# Altium project RFC_MB.PrjPcb (part 1 of 7)
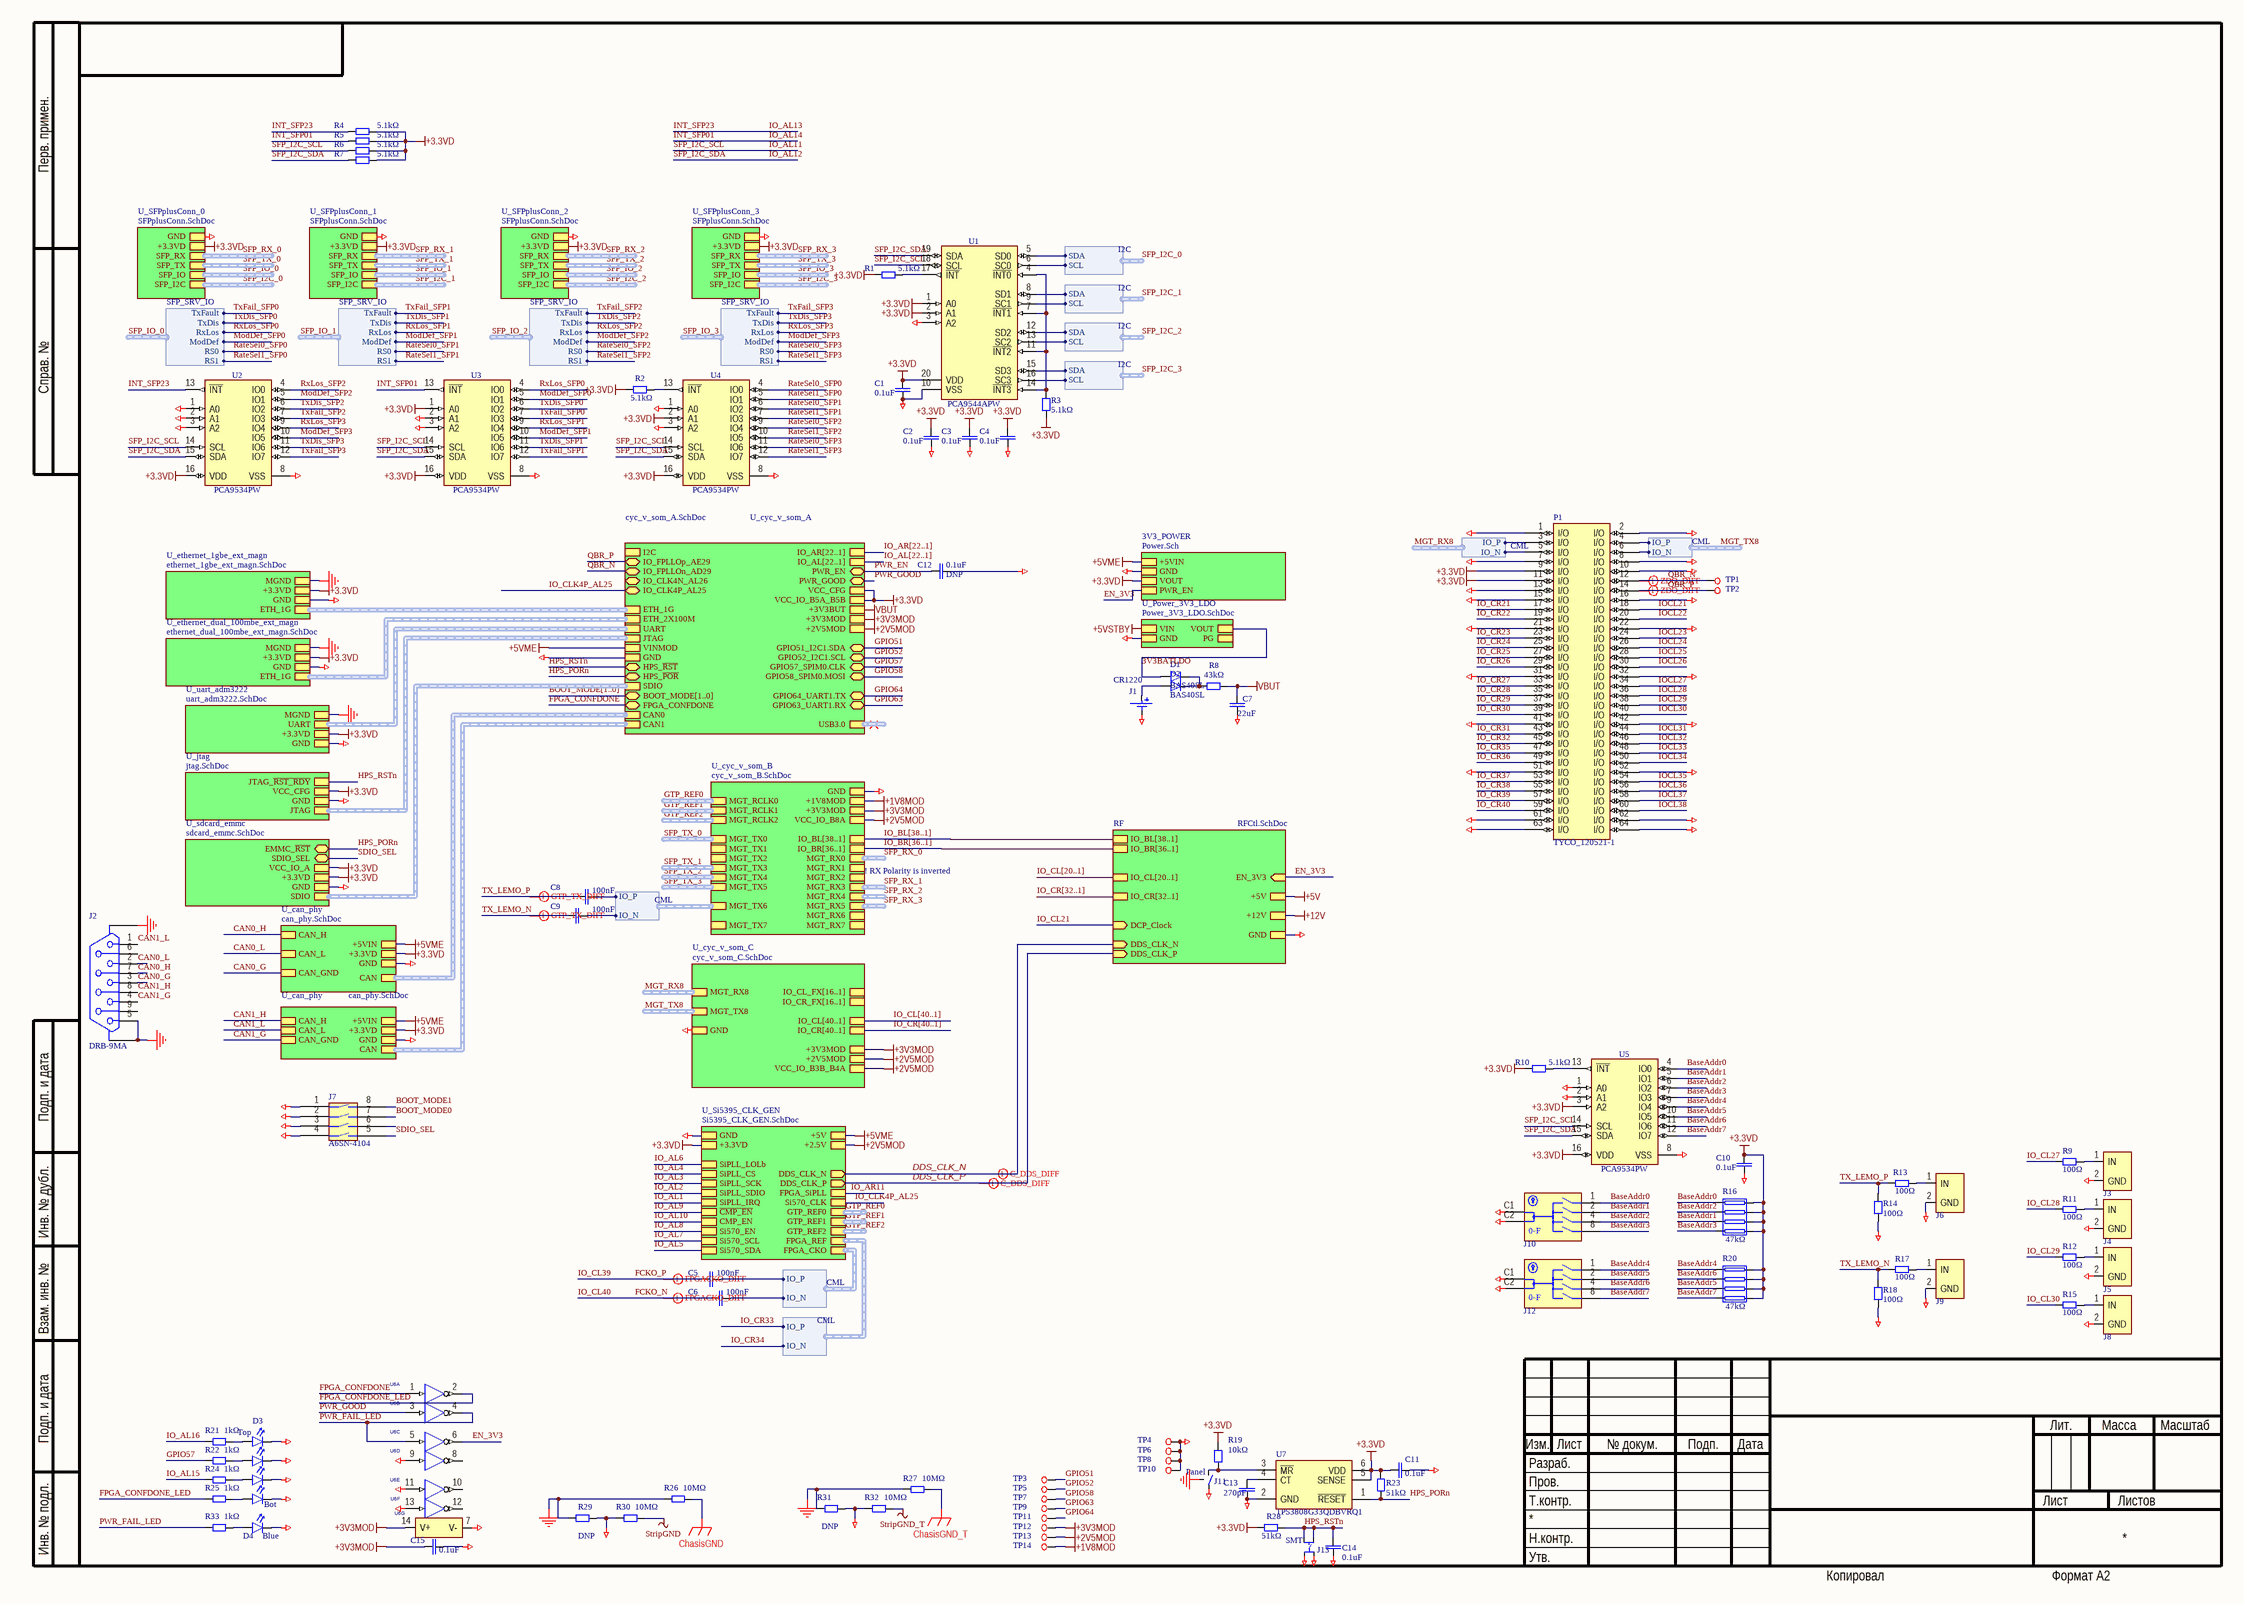
[diagram p0: main.SchDoc]
26 sheets, 1240 parts. Net scope: strictly hierarchical (ports join the sheet entries above them; power ports are local).
Board file: RFC_MB.PcbDoc
Sheets:
  main.SchDoc
    U_cyc_v_som_A = cyc_v_som_A.SchDoc
    U_cyc_v_som_B = cyc_v_som_B.SchDoc
    U_cyc_v_som_C = cyc_v_som_C.SchDoc
    U_ethernet_1gbe_ext_magn = ethernet_1gbe_ext_magn.SchDoc
    U_ethernet_dual_100mbe_ext_magn = ethernet_dual_100mbe_ext_magn.SchDoc
    U_uart_adm3222 = uart_adm3222.SchDoc
    U_jtag = jtag.SchDoc
    U_sdcard_emmc = sdcard_emmc.SchDoc
    U_can_phy = can_phy.SchDoc
    U_can_phy = can_phy.SchDoc
    U_Power_3V3_LDO = Power_3V3_LDO.SchDoc
    U_SFPplusConn_0 = SFPplusConn.SchDoc
    U_SFPplusConn_1 = SFPplusConn.SchDoc
    U_SFPplusConn_2 = SFPplusConn.SchDoc
    U_SFPplusConn_3 = SFPplusConn.SchDoc
    RF = RFCtl.SchDoc
      RF_H = Hall.SchDoc
        H_DCDC = DCDC_Hall.SchDoc
          DCP_H- = DCP_DC_DC.SchDoc
      RF_i = Integrator.SchDoc
        i_DCDC = DCDC_int.SchDoc
          DCP_i- = DCP_DC_DC.SchDoc
          DCP_i+ = DCP_DC_DC.SchDoc
      RF_D = DDS.SchDoc
        D_DCDC = DCDC_DDS.SchDoc
          DCP_D+ = DCP_DC_DC.SchDoc
          DCP_D- = DCP_DC_DC.SchDoc
      RF_S = SlowChans.SchDoc
        S_DCDC = DCDC_Slow.SchDoc
          DCP_S+ = DCP_DC_DC.SchDoc
          DCP_S- = DCP_DC_DC.SchDoc
    U_Si5395_CLK_GEN = Si5395_CLK_GEN.SchDoc
      U_power_REG104GA_1V8 = power_REG104GA_1V8.SchDoc
      U_power_REG104GA_3V3 = power_REG104GA_3V3.SchDoc
  Si5395_CLK_PWR.SchDoc

## Sheet main.SchDoc
size 594 x 420 mm

### Parts
C1  0.1uF  [CAPC2012N]
C2  0.1uF  [CAPC2012N]
C3  0.1uF  [CAPC2012N]
C4  0.1uF  [CAPC2012N]
C5  100nF  [CAPC1608N]
C6  100nF  [CAPC1608N]
C7  22uF  [CAPC2012N]
C8  100nF  [CAPC1608N]
C9  100nF  [CAPC1608N]
C10  0.1uF  [CAPC2012N]
C11  0.1uF  [CAPC2012N]
C12  PartField: 0.1uF  [CAPC2012N]  (hidden comment: DNP)
C13  270pF  [CAPC2012N]
C14  0.1uF  [CAPC2012N]
C15  0.1uF  [CAPC2012N]
D1  BAS40SL  [SOD_923]
D2  BAS40SL  [SOD_923]
D3  H485CGDL  [LED_H485C]  (value not drawn)
D4  Color: Blue  [LEDC1608N]  (hidden comment: LB Q39E-N1OO-35-1)
J1  BC501SM  [BAT_CR1220]  (value not drawn)
J2  DRB-9MA  [DRB-9MA]
J3  DNP  [LEMO_EPA.00.250.NTN]  (value not drawn)
J4  DNP  [LEMO_EPA.00.250.NTN]  (value not drawn)
J5  DNP  [LEMO_EPA.00.250.NTN]  (value not drawn)
J6  DNP  [LEMO_EPA.00.250.NTN]  (value not drawn)
J7  A6SN-4104  [DIPSW4-A6SN8]
J8  DNP  [LEMO_EPA.00.250.NTN]  (value not drawn)
J9  DNP  [LEMO_EPA.00.250.NTN]  (value not drawn)
J10  ERD116XSZ  [SW_ECE_ERD116XSZ]  (value not drawn)
J11  PTS645VL582LFS  [PTS645VL582LFS]  (value not drawn)
J12  ERD116XSZ  [SW_ECE_ERD116XSZ]  (value not drawn)
J13  PTS645SL43SMTR92  [PTS645SL43SMTR92]  (value not drawn)
P1  TYCO_120521-1  [TYCO_120521-1]
R1  5.1kΩ  [RESC2012N]
R2  5.1kΩ  [RESC2012N]
R3  5.1kΩ  [RESC2012N]
R4  5.1kΩ  [RESC2012N]
R5  5.1kΩ  [RESC2012N]
R6  5.1kΩ  [RESC2012N]
R7  5.1kΩ  [RESC2012N]
R8  43kΩ  [RESC2012N]
R9  100Ω  [RESC1608N]
R10  5.1kΩ  [RESC2012N]
R11  100Ω  [RESC1608N]
R12  100Ω  [RESC1608N]
R13  100Ω  [RESC1608N]
R14  100Ω  [RESC1608N]
R15  100Ω  [RESC1608N]
R16  value 47kΩ  [CAY16-J4]  (hidden comment: CAY16-4702F4LF)
R17  100Ω  [RESC1608N]
R18  100Ω  [RESC1608N]
R19  10kΩ  [RESC2012N]
R20  value 47kΩ  [CAY16-J4]  (hidden comment: CAY16-4702F4LF)
R21  1kΩ  [RESC2012N]
R22  1kΩ  [RESC2012N]
R23  51kΩ  [RESC2012N]
R24  1kΩ  [RESC2012N]
R25  1kΩ  [RESC2012N]
R26  10MΩ  [RESC2012N]
R27  10MΩ  [RESC2012N]
R28  51kΩ  [RESC2012N]
R29  DNP  [RESC2012N]
R30  10MΩ  [RESC2012N]
R31  DNP  [RESC2012N]
R32  10MΩ  [RESC2012N]
R33  1kΩ  [RESC2012N]
TP1  test point  [TEST_POINT]  (value not drawn)  (no BOM)
TP2  test point  [TEST_POINT]  (value not drawn)  (no BOM)
TP3  test point  [TEST_POINT]  (value not drawn)  (no BOM)
TP4  test point  [TEST_POINT]  (value not drawn)  (no BOM)
TP5  test point  [TEST_POINT]  (value not drawn)  (no BOM)
TP6  test point  [TEST_POINT]  (value not drawn)  (no BOM)
TP7  test point  [TEST_POINT]  (value not drawn)  (no BOM)
TP8  test point  [TEST_POINT]  (value not drawn)  (no BOM)
TP9  test point  [TEST_POINT]  (value not drawn)  (no BOM)
TP10  test point  [TEST_POINT]  (value not drawn)  (no BOM)
TP11  test point  [TEST_POINT]  (value not drawn)  (no BOM)
TP12  test point  [TEST_POINT]  (value not drawn)  (no BOM)
TP13  test point  [TEST_POINT]  (value not drawn)  (no BOM)
TP14  test point  [TEST_POINT]  (value not drawn)  (no BOM)
U1  PCA9544APW  [SOP65P640X110-20N]
U2  PCA9534PW  [SOP65P640X110-16N]
U3  PCA9534PW  [SOP65P640X110-16N]
U4  PCA9534PW  [SOP65P640X110-16N]
U5  PCA9534PW  [SOP65P640X110-16N]
U6  SN74LVC04APW  [SOP65P640X110-14N]  (value not drawn)  (parts A,B,C,D,E,F,G of 7)
U7  TPS3808G33QDBVRQ1  [SOT95P280X100-6N]

### Sub-sheets
3V3_POWER = Power.Sch (file not in this document): +5VIN, GND, VOUT, PWR_EN
RF = RFCtl.SchDoc: IO_BL[38..1], EN_3V3 (in), DDS_CLK_N (in), DDS_CLK_P (in), IO_CL[20..1], IO_CR[32..1], IO_BR[36..1], +5V, +12V, GND, DCP_Clock (in)
U_can_phy = can_phy.SchDoc: CAN (harness CAN), GND, +3.3VD, CAN_H, CAN_L, CAN_GND, +5VIN
U_can_phy = can_phy.SchDoc: CAN (harness CAN), GND, +3.3VD, CAN_H, CAN_L, CAN_GND, +5VIN
U_cyc_v_som_A = cyc_v_som_A.SchDoc: ETH_1G (harness EthLanes), ETH_2X100M (harness EthLanes), UART (harness UART), I2C (harness I2C), GND, VINMOD, HPS_~{RST} (bidir), HPS_~{POR} (bidir), SDIO (harness SDIO), BOOT_MODE[1..0] (bidir), FPGA_CONFDONE (bidir), CAN0 (harness CAN), CAN1 (harness CAN), IO_AR[22..1], +2V5MOD, +3V3MOD, GPIO52_I2C1.SCL (bidir), GPIO63_UART1.RX (bidir), GPIO51_I2C1.SDA (bidir), GPIO57_SPIM0.CLK (bidir), GPIO64_UART1.TX (bidir), USB3.0 (harness USB3), GPIO58_SPIM0.MOSI (bidir), +3V3BUT, IO_CLK4N_AL26 (bidir), IO_CLK4P_AL25 (bidir), PWR_EN (bidir), PWR_GOOD (bidir), VCC_IO_B5A_B5B, VCC_CFG, IO_FPLLOp_AE29 (bidir), IO_AL[22..1], IO_FPLLOn_AD29 (bidir), JTAG
U_cyc_v_som_B = cyc_v_som_B.SchDoc: GND, MGT_RCLK2 (harness CML), MGT_RCLK1 (harness CML), IO_BL[38..1], IO_BR[36..1], MGT_RCLK0 (harness CML), +1V8MOD, +3V3MOD, VCC_IO_B8A, MGT_TX5 (harness CML), MGT_TX3 (harness CML), MGT_TX6 (harness CML), MGT_TX7 (harness CML), MGT_TX2 (harness CML), MGT_TX1 (harness CML), MGT_TX4 (harness CML), MGT_TX0 (harness CML), MGT_RX0 (harness CML), MGT_RX1 (harness CML), MGT_RX6 (harness CML), MGT_RX4 (harness CML), MGT_RX5 (harness CML), MGT_RX3 (harness CML), MGT_RX2 (harness CML), MGT_RX7 (harness CML)
U_cyc_v_som_C = cyc_v_som_C.SchDoc: GND, MGT_TX8 (harness CML), IO_CL_FX[16..1], IO_CR_FX[16..1], MGT_RX8 (harness CML), IO_CL[40..1], IO_CR[40..1], +3V3MOD, +2V5MOD, VCC_IO_B3B_B4A
U_ethernet_1gbe_ext_magn = ethernet_1gbe_ext_magn.SchDoc: ETH_1G (harness EthLanes), GND, +3.3VD, MGND
U_ethernet_dual_100mbe_ext_magn = ethernet_dual_100mbe_ext_magn.SchDoc: ETH_1G (harness EthLanes), GND, +3.3VD, MGND
U_jtag = jtag.SchDoc: JTAG (harness JTAG), GND, VCC_CFG, JTAG_~{RST_RDY}
U_Power_3V3_LDO = Power_3V3_LDO.SchDoc: GND, VOUT, VIN, PG
U_sdcard_emmc = sdcard_emmc.SchDoc: SDIO (harness SDIO), GND, +3.3VD, VCC_IO_A, SDIO_SEL (bidir), EMMC_~{RST} (bidir)
U_SFPplusConn_0 = SFPplusConn.SchDoc: GND, +3.3VD, SFP_TX (harness CML), SFP_RX (harness CML), SFP_IO (harness SFP_SRV_IO), SFP_I2C (harness I2C)
U_SFPplusConn_1 = SFPplusConn.SchDoc: GND, +3.3VD, SFP_TX (harness CML), SFP_RX (harness CML), SFP_IO (harness SFP_SRV_IO), SFP_I2C (harness I2C)
U_SFPplusConn_2 = SFPplusConn.SchDoc: GND, +3.3VD, SFP_TX (harness CML), SFP_RX (harness CML), SFP_IO (harness SFP_SRV_IO), SFP_I2C (harness I2C)
U_SFPplusConn_3 = SFPplusConn.SchDoc: GND, +3.3VD, SFP_TX (harness CML), SFP_RX (harness CML), SFP_IO (harness SFP_SRV_IO), SFP_I2C (harness I2C)
U_Si5395_CLK_GEN = Si5395_CLK_GEN.SchDoc: GND, +3.3VD, +5V, Si570_CLK, Si570_SCL, Si570_SDA, Si570_EN, ~{CMP_EN}, CMP_EN, +2.5V, FPGA_SiPLL, GTP_REF1 (harness CML), GTP_REF0 (harness CML), GTP_REF2 (harness CML), FPGA_CKO (harness CML), SiPLL_IRQ, SiPLL_SDIO, SiPLL_SCK, SiPLL_CS, FPGA_REF (harness CML), SiPLL_LOLb, DDS_CLK_N (out), DDS_CLK_P (out)
U_uart_adm3222 = uart_adm3222.SchDoc: GND, +3.3VD, UART (harness UART), MGND

### Harnesses
I2C: SDA, SCL
SFP_SRV_IO: TxDis, TxFault, RS0, RS1, ModDef, RxLos
CML: IO_N, IO_P

### Nets
+1V8MOD: TP14.1 ; sheet U_cyc_v_som_B/+1V8MOD
+2V5MOD: TP13.1 ; sheet U_cyc_v_som_A/+2V5MOD, sheet U_cyc_v_som_B/VCC_IO_B8A, sheet U_cyc_v_som_C/+2V5MOD, sheet U_cyc_v_som_C/VCC_IO_B3B_B4A, sheet U_Si5395_CLK_GEN/+2.5V
+3.3VD: C1.1 C2.1 C3.1 C4.1 C10.1 C11.2 P1.9(I/O) P1.11(I/O) R1.1 R2.1 R3.2 R4.2 R5.2 R6.2 R7.2 R10.1 R16.5 R16.6 R16.7 R16.8 R19.1 R20.5 R20.6 R20.7 R20.8 R23.1 R28.1 U1.1(A0) U1.2(A1) U1.20(VDD) U2.16(VDD) U3.1(A0) U3.16(VDD) U4.2(A1) U4.16(VDD) U5.3(A2) U5.16(VDD) U7.5(SENSE) U7.6(VDD) ; sheet U_cyc_v_som_A/VCC_IO_B5A_B5B, sheet U_cyc_v_som_A/VCC_CFG, sheet U_ethernet_1gbe_ext_magn/+3.3VD, sheet U_ethernet_dual_100mbe_ext_magn/+3.3VD, sheet U_uart_adm3222/+3.3VD, sheet U_jtag/VCC_CFG, sheet U_sdcard_emmc/+3.3VD, sheet U_sdcard_emmc/VCC_IO_A, sheet 3V3_POWER/VOUT, sheet U_can_phy/+3.3VD, sheet U_can_phy/+3.3VD, sheet U_SFPplusConn_0/+3.3VD, sheet U_SFPplusConn_1/+3.3VD, sheet U_SFPplusConn_2/+3.3VD, sheet U_SFPplusConn_3/+3.3VD, sheet U_Si5395_CLK_GEN/+3.3VD
+3V3MOD: C15.2 TP12.1 U6.14(V+) ; sheet U_cyc_v_som_A/+3V3MOD, sheet U_cyc_v_som_B/+3V3MOD, sheet U_cyc_v_som_C/+3V3MOD
+5VME: sheet U_cyc_v_som_A/VINMOD, sheet 3V3_POWER/+5VIN, sheet U_can_phy/+5VIN, sheet U_can_phy/+5VIN, sheet U_Si5395_CLK_GEN/+5V
ChasisGND: R26.2
ChasisGND_T: R27.2
GND: C1.2 C2.2 C3.2 C4.2 C7.1 C10.2 C11.1 C12.1 C13.2 C14.2 C15.1 D3.2(C) D3.4(C) D3.6(C) D3.8(C) D4.1(C) J1.2(-) J3.2(GND) J4.2(GND) J5.2(GND) J6.2(GND) J7.1 J7.2 J7.3 J7.4 J8.2(GND) J9.2(GND) J10.C1(C) J10.C2(C) J11.2 J12.C1(C) J12.C2(C) J13.3 J13.4 P1.1(I/O) P1.2(I/O) P1.7(I/O) P1.8(I/O) P1.10(I/O) P1.13(I/O) P1.15(I/O) P1.16(I/O) P1.21(I/O) P1.22(I/O) P1.31(I/O) P1.32(I/O) P1.41(I/O) P1.42(I/O) P1.51(I/O) P1.52(I/O) P1.61(I/O) P1.62(I/O) P1.63(I/O) P1.64(I/O) R14.2 R18.2 R29.2 R30.1 R31.2 R32.1 TP4.1 TP6.1 TP8.1 TP10.1 U1.3(A2) U1.10(VSS) U2.1(A0) U2.2(A1) U2.3(A2) U2.8(VSS) U3.2(A1) U3.3(A2) U3.8(VSS) U4.1(A0) U4.3(A2) U4.8(VSS) U5.1(A0) U5.2(A1) U5.8(VSS) U6.7(V-) U6.9(A) U6.11(A) U6.13(A) U7.2(GND) ; sheet U_cyc_v_som_A/GND, sheet U_cyc_v_som_B/GND, sheet U_cyc_v_som_C/GND, sheet U_ethernet_1gbe_ext_magn/GND, sheet U_ethernet_dual_100mbe_ext_magn/GND, sheet U_uart_adm3222/GND, sheet U_jtag/GND, sheet U_sdcard_emmc/GND, sheet 3V3_POWER/GND, sheet U_can_phy/GND, sheet U_can_phy/GND, sheet U_Power_3V3_LDO/GND, sheet U_SFPplusConn_0/GND, sheet U_SFPplusConn_1/GND, sheet U_SFPplusConn_2/GND, sheet U_SFPplusConn_3/GND, sheet RF/GND, sheet U_Si5395_CLK_GEN/GND
MGND: J2.5 J2.S1(SHLD) J2.S2(SHLD) J11.0(S) R26.1 R27.1 R29.1 R31.1 ; sheet U_ethernet_1gbe_ext_magn/MGND, sheet U_ethernet_dual_100mbe_ext_magn/MGND, sheet U_uart_adm3222/MGND
StripGND: R30.2
StripGND_T: R32.2
VBUT: C7.2 R8.1 ; sheet U_cyc_v_som_A/+3V3BUT
3V3BATLDO: D1.1(A) ; sheet U_Power_3V3_LDO/VOUT
BaseAddr0: J10.1 R16.4 U5.4(IO0)
BaseAddr1: J10.2 R16.2 U5.5(IO1)
BaseAddr2: J10.4 R16.3 U5.6(IO2)
BaseAddr3: J10.8 R16.1 U5.7(IO3)
BaseAddr4: J12.1 R20.4 U5.9(IO4)
BaseAddr5: J12.2 R20.2 U5.10(IO5)
BaseAddr6: J12.4 R20.3 U5.11(IO6)
BaseAddr7: J12.8 R20.1 U5.12(IO7)
BOOT_MODE0: J7.7
BOOT_MODE1: J7.8
CAN0_G: J2.3 ; sheet U_can_phy/CAN_GND
CAN0_H: J2.7 ; sheet U_can_phy/CAN_H
CAN0_L: J2.2 ; sheet U_can_phy/CAN_L
CAN1_G: J2.4 ; sheet U_can_phy/CAN_GND
CAN1_H: J2.8 ; sheet U_can_phy/CAN_H
CAN1_L: J2.1 ; sheet U_can_phy/CAN_L
DDS_CLK_N: sheet RF/DDS_CLK_N, sheet U_Si5395_CLK_GEN/DDS_CLK_N
DDS_CLK_P: sheet RF/DDS_CLK_P, sheet U_Si5395_CLK_GEN/DDS_CLK_P
EN_3V3: U6.6(B) ; sheet 3V3_POWER/PWR_EN, sheet RF/EN_3V3
FCKO_N: C6.1  [also labelled IO_CL40]
FCKO_P: C5.1  [also labelled IO_CL39]
FPGA_CONFDONE: U6.1(A) ; sheet U_cyc_v_som_A/FPGA_CONFDONE
FPGA_CONFDONE_LED: R25.1 U6.2(B)
GPIO51: TP3.1 ; sheet U_cyc_v_som_A/GPIO51_I2C1.SDA
GPIO52: TP5.1 ; sheet U_cyc_v_som_A/GPIO52_I2C1.SCL
GPIO57: R22.1 ; sheet U_cyc_v_som_A/GPIO57_SPIM0.CLK
GPIO58: TP7.1 ; sheet U_cyc_v_som_A/GPIO58_SPIM0.MOSI
GPIO63: TP9.1 ; sheet U_cyc_v_som_A/GPIO63_UART1.RX
GPIO64: TP11.1 ; sheet U_cyc_v_som_A/GPIO64_UART1.TX
HPS_PORn: R23.2 U7.1(~{RESET}) ; sheet U_cyc_v_som_A/HPS_~{POR}, sheet U_sdcard_emmc/EMMC_~{RST}
HPS_RSTn: C14.1 J13.1 J13.2 R28.2 ; sheet U_cyc_v_som_A/HPS_~{RST}, sheet U_jtag/JTAG_~{RST_RDY}
IN2_N: C6.2 ; sheet U_Si5395_CLK_GEN/FPGA_CKO.IO_N
IN2_P: C5.2 ; sheet U_Si5395_CLK_GEN/FPGA_CKO.IO_P
INT_SFP01: R5.1 U3.13(~{INT})  [also labelled IO_AL14]
INT_SFP23: R4.1 U2.13(~{INT})  [also labelled IO_AL13]
IO_AL11: R6.1 U1.18(SCL) U2.14(SCL) U3.14(SCL) U4.14(SCL) U5.14(SCL)  [also labelled SFP_I2C_SCL]
IO_AL12: R7.1 U1.19(SDA) U2.15(SDA) U3.15(SDA) U4.15(SDA) U5.15(SDA)  [also labelled SFP_I2C_SDA]
IO_AL15: R24.1
IO_AL16: R21.1
IO_CL27: R9.2
IO_CL28: R11.2
IO_CL29: R12.2
IO_CL30: R15.2
IO_CLK4P_AL25: sheet U_cyc_v_som_A/IO_CLK4P_AL25, sheet U_Si5395_CLK_GEN/Si570_CLK
IO_CR21: P1.17(I/O)
IO_CR22: P1.19(I/O)
IO_CR23: P1.23(I/O)
IO_CR24: P1.25(I/O)
IO_CR25: P1.27(I/O)
IO_CR26: P1.29(I/O)
IO_CR27: P1.33(I/O)
IO_CR28: P1.35(I/O)
IO_CR29: P1.37(I/O)
IO_CR30: P1.39(I/O)
IO_CR31: P1.43(I/O)
IO_CR32: P1.45(I/O)
IO_CR35: P1.47(I/O)
IO_CR36: P1.49(I/O)
IO_CR37: P1.53(I/O)
IO_CR38: P1.55(I/O)
IO_CR39: P1.57(I/O)
IO_CR40: P1.59(I/O)
IOCL21: P1.18(I/O)
IOCL22: P1.20(I/O)
IOCL23: P1.24(I/O)
IOCL24: P1.26(I/O)
IOCL25: P1.28(I/O)
IOCL26: P1.30(I/O)
IOCL27: P1.34(I/O)
IOCL28: P1.36(I/O)
IOCL29: P1.38(I/O)
IOCL30: P1.40(I/O)
IOCL31: P1.44(I/O)
IOCL32: P1.46(I/O)
IOCL33: P1.48(I/O)
IOCL34: P1.50(I/O)
IOCL35: P1.54(I/O)
IOCL36: P1.56(I/O)
IOCL37: P1.58(I/O)
IOCL38: P1.60(I/O)
MGT_RX8.IO_N: P1.5(I/O) ; sheet U_cyc_v_som_C/MGT_RX8.IO_N
MGT_RX8.IO_P: P1.3(I/O) ; sheet U_cyc_v_som_C/MGT_RX8.IO_P
MGT_TX6_N: C9.2 ; sheet U_cyc_v_som_B/MGT_TX6.IO_N
MGT_TX6_P: C8.2 ; sheet U_cyc_v_som_B/MGT_TX6.IO_P
MGT_TX8.IO_N: P1.6(I/O) ; sheet U_cyc_v_som_C/MGT_TX8.IO_N
MGT_TX8.IO_P: P1.4(I/O) ; sheet U_cyc_v_som_C/MGT_TX8.IO_P
ModDef_SFP0: U3.5(IO1) ; sheet U_SFPplusConn_0/SFP_IO.ModDef
ModDef_SFP1: U3.10(IO5) ; sheet U_SFPplusConn_1/SFP_IO.ModDef
ModDef_SFP2: U2.5(IO1) ; sheet U_SFPplusConn_2/SFP_IO.ModDef
ModDef_SFP3: U2.10(IO5) ; sheet U_SFPplusConn_3/SFP_IO.ModDef
PWR_EN: C12.2 ; sheet U_cyc_v_som_A/PWR_EN
PWR_FAIL_LED: R33.1 U6.4(B) U6.5(A)
PWR_GOOD: U6.3(A) ; sheet U_cyc_v_som_A/PWR_GOOD
QBR_N: P1.12(I/O) TP1.1 ; sheet U_cyc_v_som_A/IO_FPLLOn_AD29
QBR_P: P1.14(I/O) TP2.1 ; sheet U_cyc_v_som_A/IO_FPLLOp_AE29
RateSel0_SFP0: U4.4(IO0) ; sheet U_SFPplusConn_0/SFP_IO.RS0
RateSel0_SFP1: U4.6(IO2) ; sheet U_SFPplusConn_1/SFP_IO.RS0
RateSel0_SFP2: U4.9(IO4) ; sheet U_SFPplusConn_2/SFP_IO.RS0
RateSel0_SFP3: U4.11(IO6) ; sheet U_SFPplusConn_3/SFP_IO.RS0
RateSel1_SFP0: U4.5(IO1) ; sheet U_SFPplusConn_0/SFP_IO.RS1
RateSel1_SFP1: U4.7(IO3) ; sheet U_SFPplusConn_1/SFP_IO.RS1
RateSel1_SFP2: U4.10(IO5) ; sheet U_SFPplusConn_2/SFP_IO.RS1
RateSel1_SFP3: U4.12(IO7) ; sheet U_SFPplusConn_3/SFP_IO.RS1
RxLos_SFP0: U3.4(IO0) ; sheet U_SFPplusConn_0/SFP_IO.RxLos
RxLos_SFP1: U3.9(IO4) ; sheet U_SFPplusConn_1/SFP_IO.RxLos
RxLos_SFP2: U2.4(IO0) ; sheet U_SFPplusConn_2/SFP_IO.RxLos
RxLos_SFP3: U2.9(IO4) ; sheet U_SFPplusConn_3/SFP_IO.RxLos
SDIO_SEL: J7.5 ; sheet U_sdcard_emmc/SDIO_SEL
SFP_I2C_0.SCL: U1.6(SC0) ; sheet U_SFPplusConn_0/SFP_I2C.SCL
SFP_I2C_0.SDA: U1.5(SD0) ; sheet U_SFPplusConn_0/SFP_I2C.SDA
SFP_I2C_1.SCL: U1.9(SC1) ; sheet U_SFPplusConn_1/SFP_I2C.SCL
SFP_I2C_1.SDA: U1.8(SD1) ; sheet U_SFPplusConn_1/SFP_I2C.SDA
SFP_I2C_2.SCL: U1.13(SC2) ; sheet U_SFPplusConn_2/SFP_I2C.SCL
SFP_I2C_2.SDA: U1.12(SD2) ; sheet U_SFPplusConn_2/SFP_I2C.SDA
SFP_I2C_3.SCL: U1.16(SC3) ; sheet U_SFPplusConn_3/SFP_I2C.SCL
SFP_I2C_3.SDA: U1.15(SD3) ; sheet U_SFPplusConn_3/SFP_I2C.SDA
TX_LEMO_N: C9.1 R17.2 R18.1
TX_LEMO_P: C8.1 R13.2 R14.1
TxDis_SFP0: U3.6(IO2) ; sheet U_SFPplusConn_0/SFP_IO.TxDis  [project net SFP_IO_0.TxDis]
TxDis_SFP1: U3.11(IO6) ; sheet U_SFPplusConn_1/SFP_IO.TxDis  [project net SFP_IO_1.TxDis]
TxDis_SFP2: U2.6(IO2) ; sheet U_SFPplusConn_2/SFP_IO.TxDis  [project net SFP_IO_2.TxDis]
TxDis_SFP3: U2.11(IO6) ; sheet U_SFPplusConn_3/SFP_IO.TxDis  [project net SFP_IO_3.TxDis]
TxFail_SFP0: U3.7(IO3) ; sheet U_SFPplusConn_0/SFP_IO.TxFault  [project net SFP_IO_0.TxFault]
TxFail_SFP1: U3.12(IO7) ; sheet U_SFPplusConn_1/SFP_IO.TxFault  [project net SFP_IO_1.TxFault]
TxFail_SFP2: U2.7(IO3) ; sheet U_SFPplusConn_2/SFP_IO.TxFault  [project net SFP_IO_2.TxFault]
TxFail_SFP3: U2.12(IO7) ; sheet U_SFPplusConn_3/SFP_IO.TxFault  [project net SFP_IO_3.TxFault]
NetC13_1: C13.1 U7.4(CT)
NetD1_2: D1.2(C) D2.2(C) R8.2
NetD2_1: D2.1(A) J1.1(+)
NetD3_1: D3.1(A) R25.2
NetD3_3: D3.3(A) R24.2
NetD3_5: D3.5(A) R22.2
NetD3_7: D3.7(A) R21.2
NetD4_2: D4.2(A) R33.2
NetJ3_1: J3.1(IN) R9.1
NetJ4_1: J4.1(IN) R11.1
NetJ5_1: J5.1(IN) R12.1
NetJ6_1: J6.1(IN) R13.1
NetJ8_1: J8.1(IN) R15.1
NetJ9_1: J9.1(IN) R17.1
NetJ11_1: J11.1 R19.2 U7.3(~{MR})
NetR1_2: R1.2 U1.17(~{INT})
NetR2_2: R2.2 U4.13(~{INT})
NetR3_1: R3.1 U1.4(~{INT0}) U1.7(~{INT1}) U1.11(~{INT2}) U1.14(~{INT3})
NetR10_2: R10.2 U5.13(~{INT})

Not connected (* = marked no-connect by the designer): J2 6 9; J7 6; U6 8(B) 10(B) 12(B)

### Buses and harness runs
bus BOOT_MODE[1..0] = sheet U_cyc_v_som_A/BOOT_MODE[1..0]
bus IO_AL[22..1] = sheet U_cyc_v_som_A/IO_AL[22..1]
bus IO_AR[22..1] = sheet U_cyc_v_som_A/IO_AR[22..1]
bus IO_BL[38..1] = sheet RF/IO_BL[38..1] = sheet U_cyc_v_som_B/IO_BL[38..1]
bus IO_BR[36..1] = sheet RF/IO_BR[36..1] = sheet U_cyc_v_som_B/IO_BR[36..1]
bus IO_CL[20..1] = sheet RF/IO_CL[20..1]
bus IO_CL[40..1] = sheet U_cyc_v_som_C/IO_CL[40..1]
bus IO_CR[32..1] = sheet RF/IO_CR[32..1]
bus IO_CR[40..1] = sheet U_cyc_v_som_C/IO_CR[40..1]
harness GTP_REF0 = sheet U_cyc_v_som_B/MGT_RCLK0
harness GTP_REF0 = sheet U_Si5395_CLK_GEN/GTP_REF0
harness GTP_REF1 = sheet U_cyc_v_som_B/MGT_RCLK1
harness GTP_REF1 = sheet U_Si5395_CLK_GEN/GTP_REF1
harness GTP_REF2 = sheet U_cyc_v_som_B/MGT_RCLK2
harness GTP_REF2 = sheet U_Si5395_CLK_GEN/GTP_REF2
harness MGT_RX8 = sheet U_cyc_v_som_C/MGT_RX8
harness MGT_TX8 = sheet U_cyc_v_som_C/MGT_TX8
harness SFP_I2C_0 = sheet U_SFPplusConn_0/SFP_I2C
harness SFP_I2C_1 = sheet U_SFPplusConn_1/SFP_I2C
harness SFP_I2C_2 = sheet U_SFPplusConn_2/SFP_I2C
harness SFP_I2C_3 = sheet U_SFPplusConn_3/SFP_I2C
harness SFP_IO_0 = sheet U_SFPplusConn_0/SFP_IO
harness SFP_IO_1 = sheet U_SFPplusConn_1/SFP_IO
harness SFP_IO_2 = sheet U_SFPplusConn_2/SFP_IO
harness SFP_IO_3 = sheet U_SFPplusConn_3/SFP_IO
harness SFP_RX_0 = sheet U_cyc_v_som_B/MGT_RX0
harness SFP_RX_0 = sheet U_SFPplusConn_0/SFP_RX
harness SFP_RX_1 = sheet U_cyc_v_som_B/MGT_RX3
harness SFP_RX_1 = sheet U_SFPplusConn_1/SFP_RX
harness SFP_RX_2 = sheet U_cyc_v_som_B/MGT_RX4
harness SFP_RX_2 = sheet U_SFPplusConn_2/SFP_RX
harness SFP_RX_3 = sheet U_cyc_v_som_B/MGT_RX5
harness SFP_RX_3 = sheet U_SFPplusConn_3/SFP_RX
harness SFP_TX_0 = sheet U_cyc_v_som_B/MGT_TX0
harness SFP_TX_0 = sheet U_SFPplusConn_0/SFP_TX
harness SFP_TX_1 = sheet U_cyc_v_som_B/MGT_TX3
harness SFP_TX_1 = sheet U_SFPplusConn_1/SFP_TX
harness SFP_TX_2 = sheet U_cyc_v_som_B/MGT_TX4
harness SFP_TX_2 = sheet U_SFPplusConn_2/SFP_TX
harness SFP_TX_3 = sheet U_cyc_v_som_B/MGT_TX5
harness SFP_TX_3 = sheet U_SFPplusConn_3/SFP_TX
harness sheet U_can_phy/CAN = sheet U_cyc_v_som_A/CAN0
harness sheet U_can_phy/CAN = sheet U_cyc_v_som_A/CAN1
harness sheet U_cyc_v_som_A/ETH_1G = sheet U_ethernet_1gbe_ext_magn/ETH_1G
harness sheet U_cyc_v_som_A/ETH_2X100M = sheet U_ethernet_dual_100mbe_ext_magn/ETH_1G
harness sheet U_cyc_v_som_A/JTAG = sheet U_jtag/JTAG
harness sheet U_cyc_v_som_A/SDIO = sheet U_sdcard_emmc/SDIO
harness sheet U_cyc_v_som_A/UART = sheet U_uart_adm3222/UART

### Layout directives
differential pair; rule Differential Pairs Routing [Pref Gap = 0.175mm    Min Gap  = 0.075mm    Max Gap  = 0.5mmPref Width = 0.25mm    Min Width  = 0.075mm    Max Width  = 0.5mm]: DDS_CLK_N, DDS_CLK_P, FCKO_N, FCKO_P, TX_LEMO_N, TX_LEMO_P
differential pair; rule Differential Pairs Routing [Pref Gap = 0.175mm    Min Gap  = 0.075mm    Max Gap  = 0.5mmPref Width = 0.15mm    Min Width  = 0.075mm    Max Width  = 0.5mm]: QBR_N, QBR_P

### Notes on the sheet
- (near J1) CR1220
- ! RX Polarity is inverted
- Перв. примен.
- Справ. №
- Подп. и дата
- Инв. № дубл.
- Взам. инв. №
- Разраб.
- Изм.
- Лист
- № докум.
- Подп.
- Дата
- Лит.
- Масса
- Масштаб
- Пров.
- Т.контр.
- Листов
- Инв. № подл.
- Утв.
- Н.контр.
- Копировал
- Формат А2
- (in symbol ERD116XSZ) 0-F
- (in symbol LEDx4_H485CGDL) Top; Bot
- (in symbol PTS645SL43SMTR92) SMT
- (in symbol PTS645VL582LFS) Panel

### Library data of the parts
C1-C4 C7 C10-C15 = CAPC: Generic ceramic SMD capacitor; Pkg: 0805; Maintainer: Evgeniy Kotov; SMD Solders: 2; THD Solders: 0; Last Change Data: 06.03.2017; Release Date: 06.03.2017
  C1-C4 C10 C11 C14 C15: PartField: 0.1uF; Value: 0.1uF
  C7: PartField: 22uF; Value: 22uF
  C12: Value: DNP
  C13: PartField: 270pF; Value: 270pF
C5 C6 C8 C9 = CAPC: Generic ceramic SMD capacitor; Pkg: 0603; Maintainer: Evgeniy Kotov; SMD Solders: 2; THD Solders: 0; PartField: 100nF; Last Change Data: 06.03.2017; Release Date: 06.03.2017; Value: 100nF
D1 D2 = BAS40SL: Schottky Barrier Diode; Pkg: SOD-923F; Vendor: Vishay; Maintainer: Evgeniy Kotov; SMD Solders: 2; THD Solders: 0; Forward Current: 100mA; Reverse Voltage: 40V; Forward Voltage: 0.38V @ 1mA / 1V @ 40mA; Reverse Current: 15mA; PartField: BAS40SL; Release Date: 28.03.2017; Last Change Data: 28.03.2017; Temperature Range: -55°C to +150°C; Value: BAS40SL
D3 = LEDx4_H485CGDL: LED Circuit Board Indicator 4 High Green (x 4) Diffused 2.1V Round with Domed Top, 1.80mm Through Hole; Pkg: 8 pin THD Led; Vendor: Bivar Inc.; Maintainer: Evgeniy Kotov; SMD Solders: 0; THD Solders: 8; Forward Current: 5mA; PartField: H485CGDL; Release Date: 28.03.2017; Last Change Data: 28.03.2017; Temperature Range: -55°C to +150°C; Value: H485CGDL; Color: Green
D4 = LED_SMD0603: SMD Led, 0603; Pkg: 0603; Vendor: Vishay; Maintainer: Evgeniy Kotov; SMD Solders: 2; THD Solders: 0; Forward Current: 5mA; PartField: LB Q39E-N1OO-35-1; Release Date: 28.03.2017; Last Change Data: 28.03.2017; Temperature Range: -55°C to +150°C; Value: LB Q39E-N1OO-35-1
J1 = BAT_CR1220: BATTERY HOLDER COIN 12.5MM SMD; SMD Solders: 2; THD Solders: 0; Maintainer: Evgeniy Kotov; Pkg: 12MM SMD; PartField: BC501SM; Last Change Data: 02.04.2017; Release Date: 02.04.2017; Value: BC501SM; ComponentLink1Description: Datasheet
J2 = DRB-9MA: D-SUB; 9-pin, male, flange 7.2mm; SolderOption: 0; THD Solders: 11; PartField: DRB-9MA; Value: DRB-9MA; Pkg: DRB-9MA; SMD Solders: 0
J3-J6 J8 J9 = LEMO_EPA.00.250: PartField: EPA.00.250.NTN; SolderOption: 0; Pkg: LEMO 5pin; THD Solders: 5; Value: DNP; SMD Solders: 0
J7 = DIPSW4: SMD DIP Switch, Omron A6H or A6SN series; SMD Solders: 8; THD Solders: 0; Pkg: SMD 8pin; Value: A6SN-4104; Manufacturer: Omron; PartField: A6SN-4104
J10 J12 = ERD116XSZ: Vendor: ECE; SolderOption: 0; Pkg: Rotary 6pin; THD Solders: 6; Value: ERD116XSZ; PartField: ERD116XSZ; SMD Solders: 0
J11 = PTS645VL582LFS: Tactile Switch SPST-NO Side Actuated Through Hole, Right Angle; SMD Solders: 0; THD Solders: 4; Maintainer: Evgeniy Kotov; Pkg: Button 4 pin; PartField: PTS645VL582LFS; Last Change Data: 02.04.2017; Release Date: 02.04.2017; Value: PTS645VL582LFS; ComponentLink1Description: Datasheet
J13 = PTS645SL43SMTR92: Tactile Switch SPST-NO Top Actuated Surface Mount; SMD Solders: 4; THD Solders: 0; Maintainer: Evgeniy Kotov; Pkg: Button 4 pin; PartField: PTS645SL43SMTR92; Last Change Data: 02.04.2017; Release Date: 02.04.2017; Value: PTS645SL43SMTR92; ComponentLink1Description: Datasheet
P1 = PCI_PMC_TYCO_120521-1: PCI Mezzanine Connector; IEEE 1386; Manufacturer: TE Connectivity; Value: DNP; SMD Solders: 64; THD Solders: 0; Pkg: SMD 64 pin; PartField: TYCO_120521-1
R1-R8 R10 R19 R21-R28 R30 R32 R33 = RESC: Resistor, Generic, SMD; Pkg: 0805; Maintainer: Evgeniy Kotov; SMD Solders: 2; THD Solders: 0; Release Date: 06.03.2017; Last Change Data: 09.03.2017
  R1-R7 R10: PartField: 5.1kΩ; Value: 5.1kΩ
  R8: PartField: 43kΩ; Value: 43kΩ
  R19: PartField: 10kΩ; Value: 10kΩ
  R21 R22 R24 R25 R33: PartField: 1kΩ; Value: 1kΩ
  R23 R28: PartField: 51kΩ; Value: 51kΩ
  R26 R27 R30 R32: PartField: 10MΩ; Value: 10MΩ
R9 R11-R15 R17 R18 = RESC: Resistor, Generic, SMD; Pkg: 0603; Maintainer: Evgeniy Kotov; SMD Solders: 2; THD Solders: 0; PartField: 100Ω; Release Date: 06.03.2017; Last Change Data: 09.03.2017; Value: 100Ω
R16 R20 = RESPACK4: Maintainer: Anton Pavlenko; Pkg: SMD 8pin; SMD Solders: 8; THD Solders: 0; PartField: CAY16-4702F4LF; Last Change Data: 16.05.2019; Release Date: 16.05.2019
R29 R31 = RESC: Resistor, Generic, SMD; PartField: 0Ω; Pkg: 0805; Maintainer: Evgeniy Kotov; SMD Solders: 2; THD Solders: 0; Release Date: 06.03.2017; Last Change Data: 09.03.2017; Value: DNP
TP1-TP14 = TestPoint: Vendor: BINP; SolderOption: 0; Pkg: DNP; PartField: test point; Value: test point; SMD Solders: 0; THD Solders: 0
U1 = PCA9544APW: 4-Channel I2C-Bus Multiplexer with Interrupt Logic; Manufacturer: NXP SEMICONDUCTORS; PressFit: No; Bonding: No; Pkg: SSOP20; SMD Solders: 20; THD Solders: 0; Part Number: PCA9544APW; Component Kind: Standard; Component Type: Standard; Device: PCA9544APW; PackageDescription: SOP, 20-Leads, Body 6.6x4.5mm (max), Pitch 0.65mm, IPC Medium Density; Part Description: 4-Channel I2C-Bus Multiplexer with Interrupt Logic; Manufacturer Part Number: PCA9544APW; Pin Count: 20; Case: SSOP20; Mounted: Yes; Socket: No; SMD: Yes; ComponentHeight: 1.1mm; Author: CERN DEM JLC; HelpURL: \\cern.ch\dfs\Applications\Altium\Datasheets\PCA9544APW.pdf; CreateDate: 06/10/2014; LatestRevisionDate: 06/10/2014; Sense: No; Value: PCA9544APW; PartField: PCA9544APW
U2-U5 = PCA9534PW: 8-Bit I2C-Bus and SMBus Low Power I/O Port with Interrupt; Manufacturer: ANALOG DEVICES; PressFit: No; Bonding: No; Pkg: SSOP16; SMD Solders: 16; THD Solders: 0; Part Number: PCA9534PW; Component Kind: Standard; Component Type: Standard; Device: PCA9534PW; PackageDescription: SOP, 0.65mm pitch; 16 pin, 4.40mm W X 5.00mm L X 1.10mm H body IPC Medium Density; Part Description: 8-Bit I2C-Bus and SMBus Low Power I/O Port with Interrupt; Manufacturer Part Number: PCA9534PW; Pin Count: 16; Case: SSOP16; Mounted: Yes; Socket: No; SMD: Yes; ComponentHeight: 1.1mm; Author: CERN DEM JLC; HelpURL: \\cern.ch\dfs\Applications\Altium\Datasheets\PCA9534PW.pdf; CreateDate: 18/12/2013; LatestRevisionDate: 18/12/2013; Sense: No; Value: PCA9534PW; PartField: PCA9534PW
U6 = SN74LVC04APW: Sextuple NOR Gate; Manufacturer: Texas Instruments; INDUSTRY_STD_PKG_TYPE: TSSOP; FAMILY_NAME: NOR_GATE; PIN_COUNT: 14; PACKAGE_DESIGNATOR: PW; Pkg: PW-14; THD Solders: 0; Value: SN74LVC04APW; HelpURL: http://www.ti.com/lit/ds/symlink/sn74lvc04a.pdf; GENERIC_PART_NUMBER: SN74LVC04APW; Vendor: Texas Instruments; Manufacturer_Part_Number: SN74LVC04APW; SMD Solders: 14; PartField: SN74LVC04APW
U7 = TPS3808G33QDBVRQ1: Low-Quiescent-Current Programmable-Delay Supervisory Circuit; Pkg: SOT23-6; SMD Solders: 6; THD Solders: 0; Maintainer: Evgeniy Kotov; Vendor: Texas Instruments; PartField: TPS3808G33QDBVRQ1; ComponentLink1URL: http://www.ti.com/lit/ds/symlink/dac7565.pdf; ComponentLink1Description: Datasheet; Last Change Date: 19.03.2017; Release Date: 19.03.2017; Value: TPS3808G33QDBVRQ1

## Sheet cyc_v_som_A.SchDoc
size A3
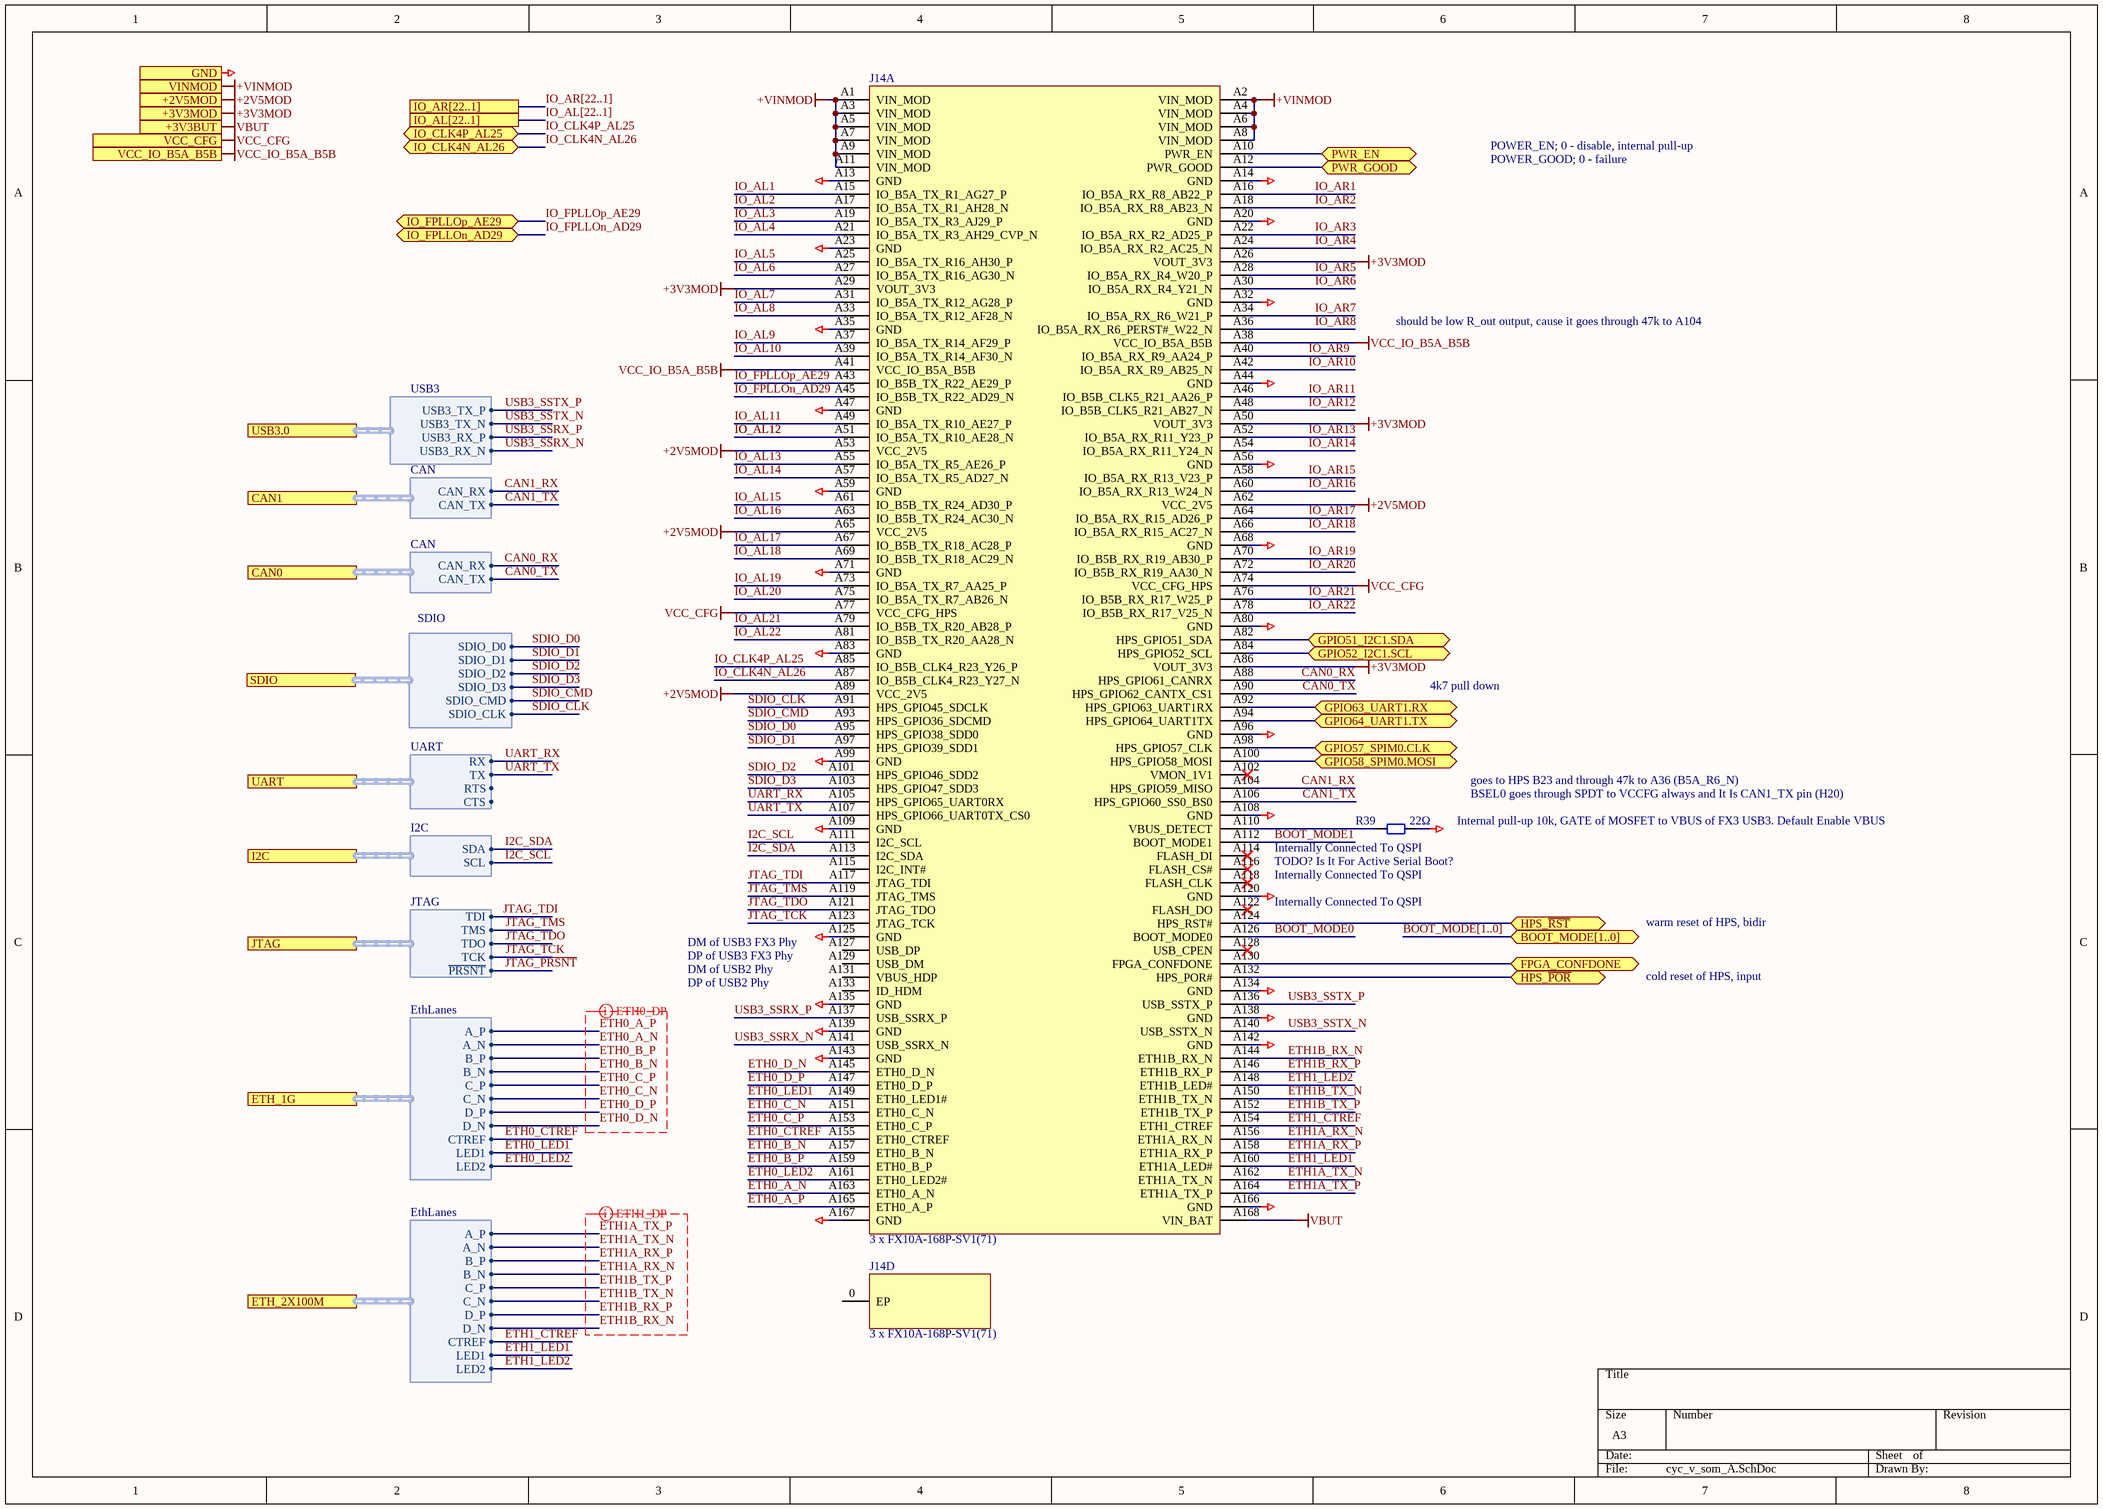
[diagram p1: cyc_v_som_A.SchDoc]

### Parts
J14  3 x FX10A-168P-SV1(71)  [Mercury_SA2p]  (parts A,D of 4)
R39  22Ω  [RESC1608N]

### Ports
+2V5MOD, +3V3BUT, +3V3MOD, BOOT_MODE[1..0] (bidir), CAN0 (harness CAN), CAN1 (harness CAN), ETH_1G (harness EthLanes), ETH_2X100M (harness EthLanes), FPGA_CONFDONE (bidir), GND, GPIO51_I2C1.SDA (bidir), GPIO52_I2C1.SCL (bidir), GPIO57_SPIM0.CLK (bidir), GPIO58_SPIM0.MOSI (bidir), GPIO63_UART1.RX (bidir), GPIO64_UART1.TX (bidir), HPS_~{POR} (bidir), HPS_~{RST} (bidir), I2C (harness I2C), IO_AL[22..1], IO_AR[22..1], IO_CLK4N_AL26 (bidir), IO_CLK4P_AL25 (bidir), IO_FPLLOn_AD29 (bidir), IO_FPLLOp_AE29 (bidir), JTAG (harness JTAG), PWR_EN (bidir), PWR_GOOD (bidir), SDIO (harness SDIO), UART (harness UART), USB3.0 (harness USB3), VCC_CFG, VCC_IO_B5A_B5B, VINMOD

### Harnesses
EthLanes: A_P, A_N, B_P, B_N, C_P, C_N, D_P, D_N, LED1, LED2, CTREF
I2C: SDA, SCL
UART: RX, TX, RTS, CTS
JTAG: TDI, TMS, TDO, TCK, ~{PRSNT}
SDIO: SDIO_D0, SDIO_D1, SDIO_D2, SDIO_D3, SDIO_CMD, SDIO_CLK
CAN: CAN_TX, CAN_RX
USB3: USB3_TX_P, USB3_TX_N, USB3_RX_P, USB3_RX_N

### Nets
+2V5MOD: J14.A53(VCC_2V5) J14.A62(VCC_2V5) J14.A65(VCC_2V5) J14.A89(VCC_2V5) ; port +2V5MOD
+3V3MOD: J14.A26(VOUT_3V3) J14.A29(VOUT_3V3) J14.A50(VOUT_3V3) J14.A86(VOUT_3V3) ; port +3V3MOD
+VINMOD: J14.A1(VIN_MOD) J14.A2(VIN_MOD) J14.A3(VIN_MOD) J14.A4(VIN_MOD) J14.A5(VIN_MOD) J14.A6(VIN_MOD) J14.A7(VIN_MOD) J14.A8(VIN_MOD) J14.A9(VIN_MOD) J14.A11(VIN_MOD) ; port VINMOD  [project net +5VME]
GND: J14.A13(GND) J14.A14(GND) J14.A20(GND) J14.A23(GND) J14.A32(GND) J14.A35(GND) J14.A44(GND) J14.A47(GND) J14.A56(GND) J14.A59(GND) J14.A68(GND) J14.A71(GND) J14.A80(GND) J14.A83(GND) J14.A96(GND) J14.A99(GND) J14.A108(GND) J14.A109(GND) J14.A120(GND) J14.A125(GND) J14.A134(GND) J14.A135(GND) J14.A138(GND) J14.A139(GND) J14.A142(GND) J14.A143(GND) J14.A166(GND) J14.A167(GND) R39.2 ; port GND
VBUT: J14.A168(VIN_BAT) ; port +3V3BUT
VCC_CFG: J14.A38(VCC_IO_B5A_B5B) J14.A41(VCC_IO_B5A_B5B) J14.A74(VCC_CFG_HPS) J14.A77(VCC_CFG_HPS) ; port VCC_CFG, port VCC_IO_B5A_B5B  [also labelled VCC_IO_B5A_B5B]  [project net +3.3VD]
BOOT_MODE0: J14.A126(BOOT_MODE0)
BOOT_MODE1: J14.A112(BOOT_MODE1)
CAN0_RX: J14.A88(HPS_GPIO61_CANRX) ; port CAN0.CAN_RX
CAN0_TX: J14.A90(HPS_GPIO62_CANTX_CS1) ; port CAN0.CAN_TX
CAN1_RX: J14.A104(HPS_GPIO59_MISO) ; port CAN1.CAN_RX
CAN1_TX: J14.A106(HPS_GPIO60_SS0_BS0) ; port CAN1.CAN_TX
ETH0_A_N: J14.A163(ETH0_A_N) ; port ETH_1G.A_N
ETH0_A_P: J14.A165(ETH0_A_P) ; port ETH_1G.A_P
ETH0_B_N: J14.A157(ETH0_B_N) ; port ETH_1G.B_N
ETH0_B_P: J14.A159(ETH0_B_P) ; port ETH_1G.B_P
ETH0_C_N: J14.A151(ETH0_C_N) ; port ETH_1G.C_N
ETH0_C_P: J14.A153(ETH0_C_P) ; port ETH_1G.C_P
ETH0_CTREF: J14.A155(ETH0_CTREF) ; port ETH_1G.CTREF
ETH0_D_N: J14.A145(ETH0_D_N) ; port ETH_1G.D_N
ETH0_D_P: J14.A147(ETH0_D_P) ; port ETH_1G.D_P
ETH0_LED1: J14.A149(ETH0_LED1#) ; port ETH_1G.LED1
ETH0_LED2: J14.A161(ETH0_LED2#) ; port ETH_1G.LED2
ETH1_CTREF: J14.A154(ETH1_CTREF) ; port ETH_2X100M.CTREF
ETH1_LED1: J14.A160(ETH1A_LED#) ; port ETH_2X100M.LED1
ETH1_LED2: J14.A148(ETH1B_LED#) ; port ETH_2X100M.LED2
ETH1A_RX_N: J14.A156(ETH1A_RX_N) ; port ETH_2X100M.B_N
ETH1A_RX_P: J14.A158(ETH1A_RX_P) ; port ETH_2X100M.B_P
ETH1A_TX_N: J14.A162(ETH1A_TX_N) ; port ETH_2X100M.A_N
ETH1A_TX_P: J14.A164(ETH1A_TX_P) ; port ETH_2X100M.A_P
ETH1B_RX_N: J14.A144(ETH1B_RX_N) ; port ETH_2X100M.D_N
ETH1B_RX_P: J14.A146(ETH1B_RX_P) ; port ETH_2X100M.D_P
ETH1B_TX_N: J14.A150(ETH1B_TX_N) ; port ETH_2X100M.C_N
ETH1B_TX_P: J14.A152(ETH1B_TX_P) ; port ETH_2X100M.C_P
FPGA_CONFDONE: J14.A130(FPGA_CONFDONE) ; port FPGA_CONFDONE
GPIO51: J14.A82(HPS_GPIO51_SDA) ; port GPIO51_I2C1.SDA
GPIO52: J14.A84(HPS_GPIO52_SCL) ; port GPIO52_I2C1.SCL
GPIO57: J14.A98(HPS_GPIO57_CLK) ; port GPIO57_SPIM0.CLK
GPIO58: J14.A100(HPS_GPIO58_MOSI) ; port GPIO58_SPIM0.MOSI
GPIO63: J14.A92(HPS_GPIO63_UART1RX) ; port GPIO63_UART1.RX
GPIO64: J14.A94(HPS_GPIO64_UART1TX) ; port GPIO64_UART1.TX
HPS_PORn: J14.A132(HPS_POR#) ; port HPS_~{POR}
HPS_RSTn: J14.A124(HPS_RST#) ; port HPS_~{RST}
I2C_SCL: J14.A111(I2C_SCL) ; port I2C.SCL
I2C_SDA: J14.A113(I2C_SDA) ; port I2C.SDA
IO_AL1: J14.A15(IO_B5A_TX_R1_AG27_P)
IO_AL2: J14.A17(IO_B5A_TX_R1_AH28_N)
IO_AL3: J14.A19(IO_B5A_TX_R3_AJ29_P)
IO_AL4: J14.A21(IO_B5A_TX_R3_AH29_CVP_N)
IO_AL5: J14.A25(IO_B5A_TX_R16_AH30_P)
IO_AL6: J14.A27(IO_B5A_TX_R16_AG30_N)
IO_AL7: J14.A31(IO_B5A_TX_R12_AG28_P)
IO_AL8: J14.A33(IO_B5A_TX_R12_AF28_N)
IO_AL9: J14.A37(IO_B5A_TX_R14_AF29_P)
IO_AL10: J14.A39(IO_B5A_TX_R14_AF30_N)
IO_AL11: J14.A49(IO_B5A_TX_R10_AE27_P)
IO_AL12: J14.A51(IO_B5A_TX_R10_AE28_N)
IO_AL13: J14.A55(IO_B5A_TX_R5_AE26_P)  [project net INT_SFP23]
IO_AL14: J14.A57(IO_B5A_TX_R5_AD27_N)  [project net INT_SFP01]
IO_AL15: J14.A61(IO_B5B_TX_R24_AD30_P)
IO_AL16: J14.A63(IO_B5B_TX_R24_AC30_N)
IO_AL17: J14.A67(IO_B5B_TX_R18_AC28_P)
IO_AL18: J14.A69(IO_B5B_TX_R18_AC29_N)
IO_AL19: J14.A73(IO_B5A_TX_R7_AA25_P)
IO_AL20: J14.A75(IO_B5A_TX_R7_AB26_N)
IO_AL21: J14.A79(IO_B5B_TX_R20_AB28_P)
IO_AL22: J14.A81(IO_B5B_TX_R20_AA28_N)
IO_AR1: J14.A16(IO_B5A_RX_R8_AB22_P)
IO_AR2: J14.A18(IO_B5A_RX_R8_AB23_N)
IO_AR3: J14.A22(IO_B5A_RX_R2_AD25_P)
IO_AR4: J14.A24(IO_B5A_RX_R2_AC25_N)
IO_AR5: J14.A28(IO_B5A_RX_R4_W20_P)
IO_AR6: J14.A30(IO_B5A_RX_R4_Y21_N)
IO_AR7: J14.A34(IO_B5A_RX_R6_W21_P)
IO_AR8: J14.A36(IO_B5A_RX_R6_PERST#_W22_N)
IO_AR9: J14.A40(IO_B5A_RX_R9_AA24_P)
IO_AR10: J14.A42(IO_B5A_RX_R9_AB25_N)
IO_AR11: J14.A46(IO_B5B_CLK5_R21_AA26_P)
IO_AR12: J14.A48(IO_B5B_CLK5_R21_AB27_N)
IO_AR13: J14.A52(IO_B5A_RX_R11_Y23_P)
IO_AR14: J14.A54(IO_B5A_RX_R11_Y24_N)
IO_AR15: J14.A58(IO_B5A_RX_R13_V23_P)
IO_AR16: J14.A60(IO_B5A_RX_R13_W24_N)
IO_AR17: J14.A64(IO_B5A_RX_R15_AD26_P)
IO_AR18: J14.A66(IO_B5A_RX_R15_AC27_N)
IO_AR19: J14.A70(IO_B5B_RX_R19_AB30_P)
IO_AR20: J14.A72(IO_B5B_RX_R19_AA30_N)
IO_AR21: J14.A76(IO_B5B_RX_R17_W25_P)
IO_AR22: J14.A78(IO_B5B_RX_R17_V25_N)
IO_CLK4N_AL26: J14.A87(IO_B5B_CLK4_R23_Y27_N) ; port IO_CLK4N_AL26
IO_CLK4P_AL25: J14.A85(IO_B5B_CLK4_R23_Y26_P) ; port IO_CLK4P_AL25
IO_FPLLOn_AD29: J14.A45(IO_B5B_TX_R22_AD29_N) ; port IO_FPLLOn_AD29  [project net QBR_N]
IO_FPLLOp_AE29: J14.A43(IO_B5B_TX_R22_AE29_P) ; port IO_FPLLOp_AE29  [project net QBR_P]
JTAG_TCK: J14.A123(JTAG_TCK) ; port JTAG.TCK
JTAG_TDI: J14.A117(JTAG_TDI) ; port JTAG.TDI
JTAG_TDO: J14.A121(JTAG_TDO) ; port JTAG.TDO
JTAG_TMS: J14.A119(JTAG_TMS) ; port JTAG.TMS
PWR_EN: J14.A10(PWR_EN) ; port PWR_EN
PWR_GOOD: J14.A12(PWR_GOOD) ; port PWR_GOOD
SDIO_CLK: J14.A91(HPS_GPIO45_SDCLK) ; port SDIO.SDIO_CLK
SDIO_CMD: J14.A93(HPS_GPIO36_SDCMD) ; port SDIO.SDIO_CMD
SDIO_D0: J14.A95(HPS_GPIO38_SDD0) ; port SDIO.SDIO_D0
SDIO_D1: J14.A97(HPS_GPIO39_SDD1) ; port SDIO.SDIO_D1
SDIO_D2: J14.A101(HPS_GPIO46_SDD2) ; port SDIO.SDIO_D2
SDIO_D3: J14.A103(HPS_GPIO47_SDD3) ; port SDIO.SDIO_D3
UART_RX: J14.A105(HPS_GPIO65_UART0RX) ; port UART.RX
UART_TX: J14.A107(HPS_GPIO66_UART0TX_CS0) ; port UART.TX
USB3_SSRX_N: J14.A141(USB_SSRX_N) ; port USB3.0.USB3_RX_N
USB3_SSRX_P: J14.A137(USB_SSRX_P) ; port USB3.0.USB3_RX_P
USB3_SSTX_N: J14.A140(USB_SSTX_N) ; port USB3.0.USB3_TX_N
USB3_SSTX_P: J14.A136(USB_SSTX_P) ; port USB3.0.USB3_TX_P
NetJ14_A110: J14.A110(VBUS_DETECT) R39.1

Not connected (* = marked no-connect by the designer): J14 0(EP) A102(VMON_1V1)* A114(FLASH_DI)* A115(I2C_INT#) A116(FLASH_CS#)* A118(FLASH_CLK)* A122(FLASH_DO)* A127(USB_DP) A128(USB_CPEN)* A129(USB_DM) A131(VBUS_HDP) A133(ID_HDM)

### Buses and harness runs
bus BOOT_MODE[1..0] = port BOOT_MODE[1..0]
bus IO_AL[22..1] = port IO_AL[22..1]
bus IO_AR[22..1] = port IO_AR[22..1]

### Layout directives
differential pair; rule Differential Pairs Routing [Pref Gap = 0.175mm    Min Gap  = 0.075mm    Max Gap  = 0.5mmPref Width = 0.25mm    Min Width  = 0.075mm    Max Width  = 0.5mm]: ETH0_A_N, ETH0_A_P, ETH0_B_N, ETH0_B_P, ETH0_C_N, ETH0_C_P, ETH0_D_N, ETH0_D_P, ETH1A_RX_N, ETH1A_RX_P, ETH1A_TX_N, ETH1A_TX_P, ETH1B_RX_N, ETH1B_RX_P, ETH1B_TX_N, ETH1B_TX_P

### Notes on the sheet
- POWER_GOOD; 0 - failure
- POWER_EN; 0 - disable, internal pull-up
- should be low R_out output, cause it goes through 47k to A104
- 4k7 pull down
- goes to HPS B23 and through 47k to A36 (B5A_R6_N)
- (near R39) Internally Connected To QSPI
- (near R39) Internal pull-up 10k, GATE of MOSFET to VBUS of FX3 USB3. Default Enable VBUS
- BSEL0 goes through SPDT to VCCFG always and It Is CAN1_TX pin (H20)
- (near R39) TODO? Is It For Active Serial Boot?
- Internally Connected To QSPI
- DP of USB2 Phy
- DM of USB2 Phy
- DP of USB3 FX3 Phy
- DM of USB3 FX3 Phy
- warm reset of HPS, bidir
- cold reset of HPS, input

### Library data of the parts
J14 = FX10A-168P-SV_ME-SA2+: Pin_Count: 168; SolderOption: 0; Pkg: SMD 170pin; SMD Solders: 170; HelpURL: https://www.hirose.com/product/document?clcode=CL0570-0044-8-71&productname=FX10A-168P-SV(71)&series=FX10&documenttype=Catalog&lang=ru&documentid=D31650_en; PartField: FX10A-168P-SV1(71); Value: 3 x FX10A-168P-SV1(71); THD Solders: 0
R39 = RESC: as R9 on sheet main; PartField: 22Ω; Release Date: 06.03.2017; Last Change Data: 09.03.2017; Value: 22Ω

## Sheet cyc_v_som_B.SchDoc
size A3
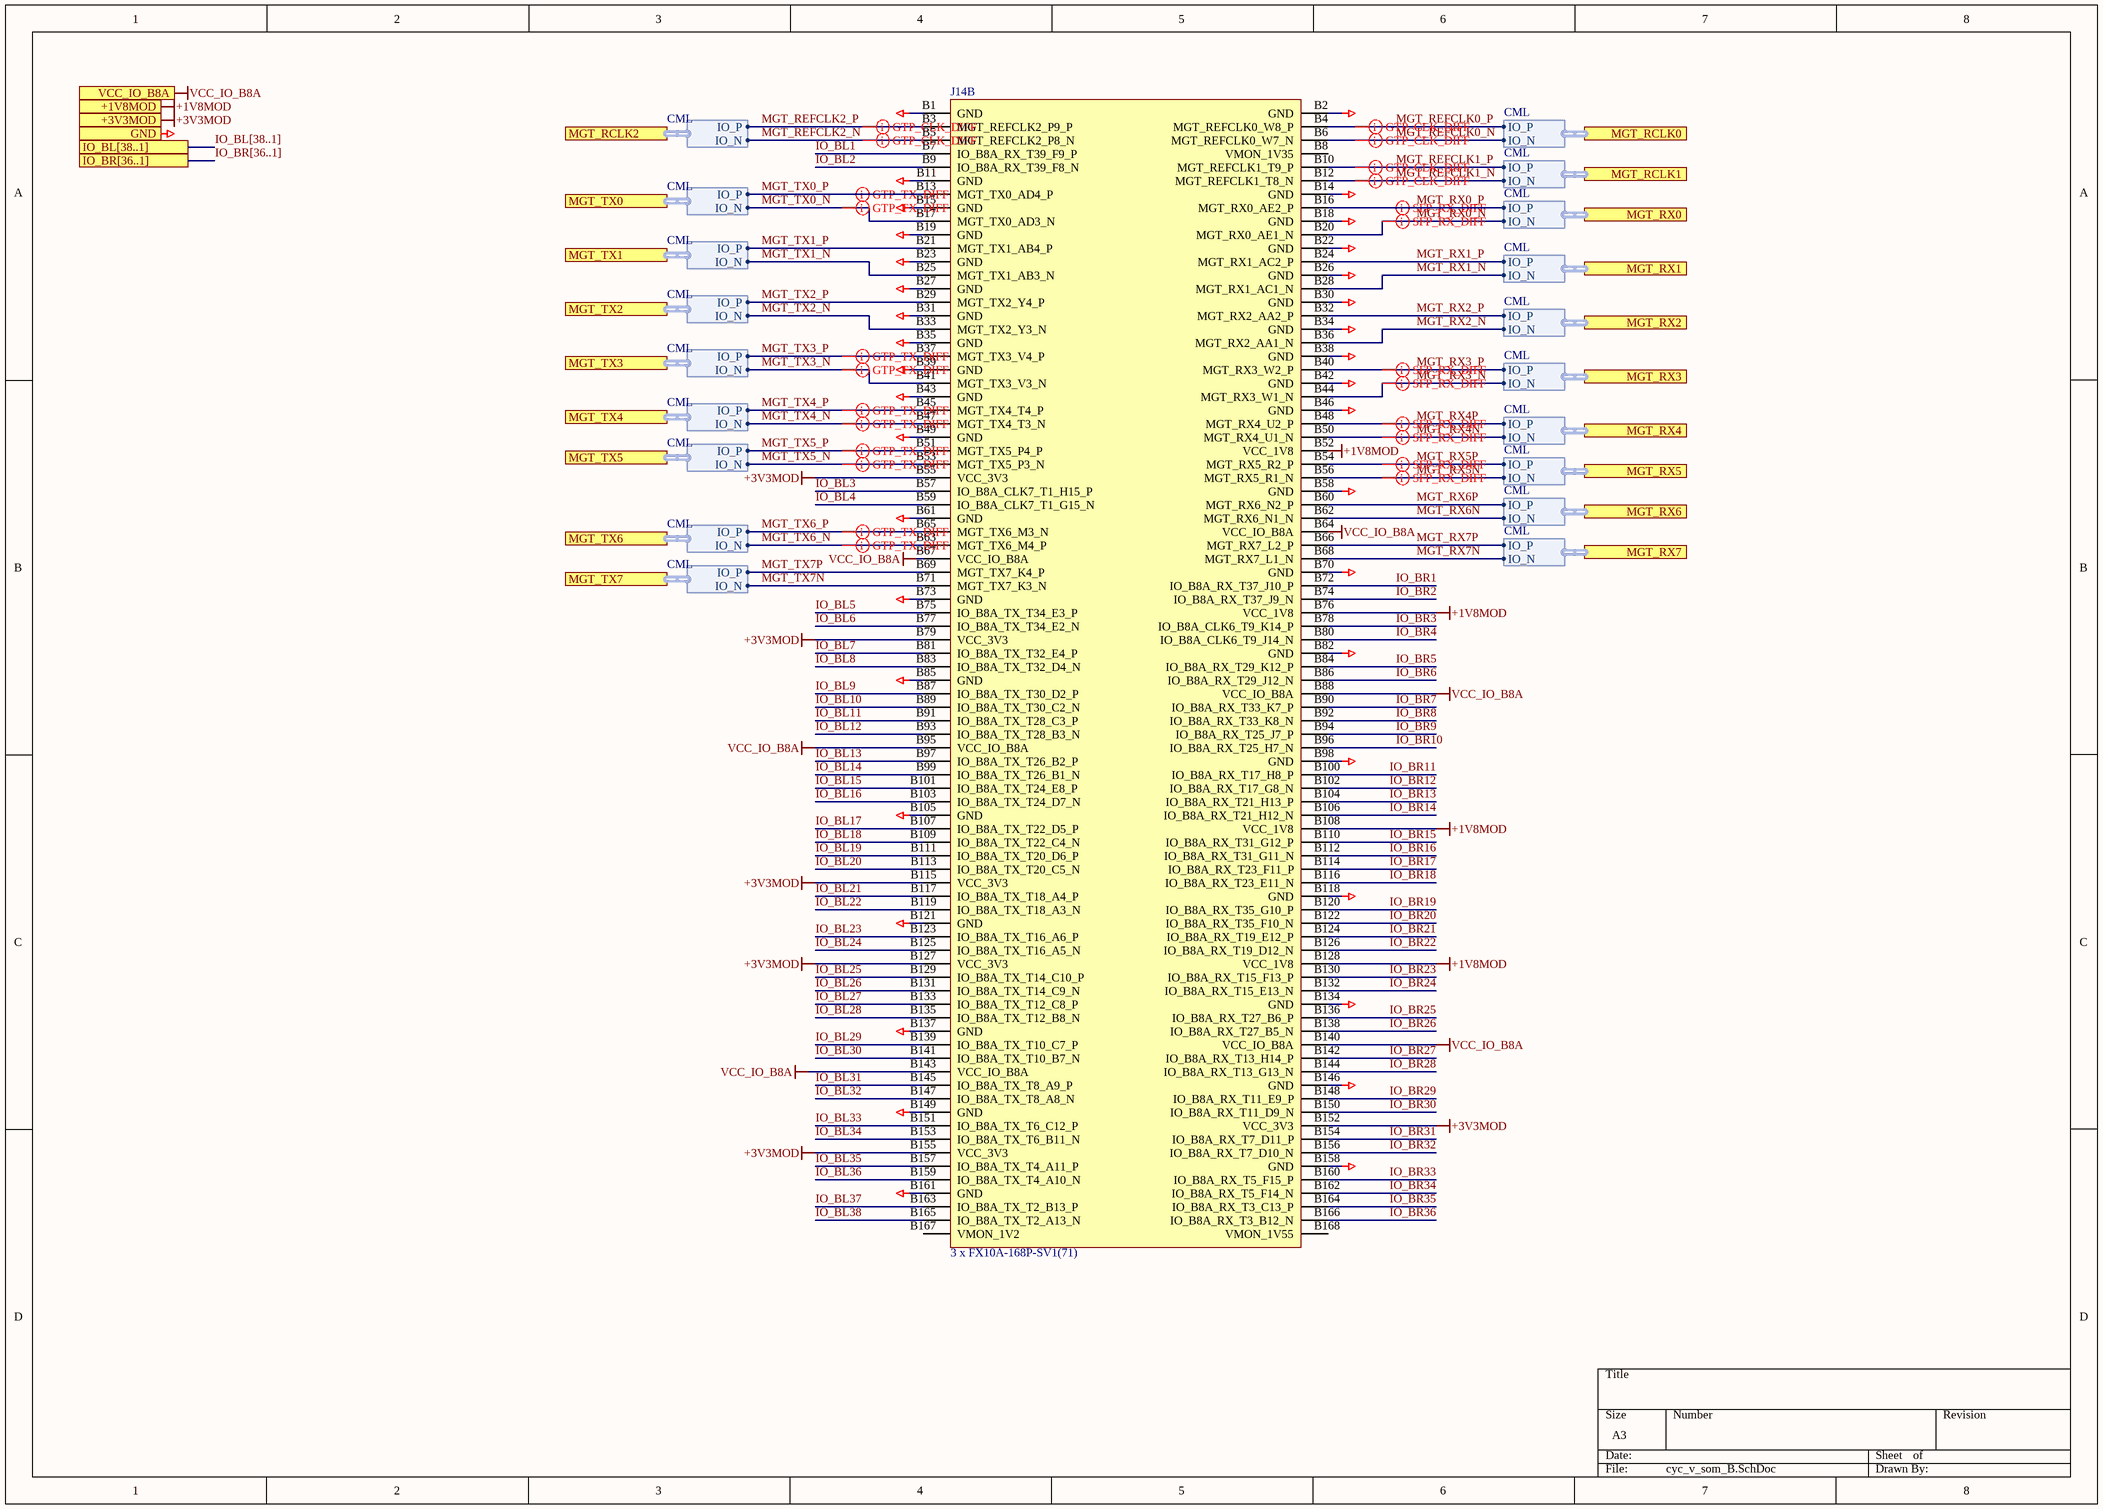
[diagram p2: cyc_v_som_B.SchDoc]

### Parts
J14  3 x FX10A-168P-SV1(71)  [Mercury_SA2p]  (part B of 4)

### Ports
+1V8MOD, +3V3MOD, GND, IO_BL[38..1], IO_BR[36..1], MGT_RCLK0 (harness CML), MGT_RCLK1 (harness CML), MGT_RCLK2 (harness CML), MGT_RX0 (harness CML), MGT_RX1 (harness CML), MGT_RX2 (harness CML), MGT_RX3 (harness CML), MGT_RX4 (harness CML), MGT_RX5 (harness CML), MGT_RX6 (harness CML), MGT_RX7 (harness CML), MGT_TX0 (harness CML), MGT_TX1 (harness CML), MGT_TX2 (harness CML), MGT_TX3 (harness CML), MGT_TX4 (harness CML), MGT_TX5 (harness CML), MGT_TX6 (harness CML), MGT_TX7 (harness CML), VCC_IO_B8A

### Harnesses
CML: IO_N, IO_P

### Nets
+1V8MOD: J14.B52(VCC_1V8) J14.B76(VCC_1V8) J14.B108(VCC_1V8) J14.B128(VCC_1V8) ; port +1V8MOD
+3V3MOD: J14.B55(VCC_3V3) J14.B79(VCC_3V3) J14.B115(VCC_3V3) J14.B127(VCC_3V3) J14.B152(VCC_3V3) J14.B155(VCC_3V3) ; port +3V3MOD
GND: J14.B1(GND) J14.B2(GND) J14.B11(GND) J14.B14(GND) J14.B15(GND) J14.B18(GND) J14.B19(GND) J14.B22(GND) J14.B23(GND) J14.B26(GND) J14.B27(GND) J14.B30(GND) J14.B31(GND) J14.B34(GND) J14.B35(GND) J14.B38(GND) J14.B39(GND) J14.B42(GND) J14.B43(GND) J14.B46(GND) J14.B49(GND) J14.B58(GND) J14.B61(GND) J14.B70(GND) J14.B73(GND) J14.B82(GND) J14.B85(GND) J14.B98(GND) J14.B105(GND) J14.B118(GND) J14.B121(GND) J14.B134(GND) J14.B137(GND) J14.B146(GND) J14.B149(GND) J14.B158(GND) J14.B161(GND) ; port GND
VCC_IO_B8A: J14.B64(VCC_IO_B8A) J14.B67(VCC_IO_B8A) J14.B88(VCC_IO_B8A) J14.B95(VCC_IO_B8A) J14.B140(VCC_IO_B8A) J14.B143(VCC_IO_B8A) ; port VCC_IO_B8A  [project net +2V5MOD]
IO_BL1: J14.B7(IO_B8A_RX_T39_F9_P)
IO_BL2: J14.B9(IO_B8A_RX_T39_F8_N)
IO_BL3: J14.B57(IO_B8A_CLK7_T1_H15_P)
IO_BL4: J14.B59(IO_B8A_CLK7_T1_G15_N)
IO_BL5: J14.B75(IO_B8A_TX_T34_E3_P)
IO_BL6: J14.B77(IO_B8A_TX_T34_E2_N)
IO_BL7: J14.B81(IO_B8A_TX_T32_E4_P)
IO_BL8: J14.B83(IO_B8A_TX_T32_D4_N)
IO_BL9: J14.B87(IO_B8A_TX_T30_D2_P)
IO_BL10: J14.B89(IO_B8A_TX_T30_C2_N)
IO_BL11: J14.B91(IO_B8A_TX_T28_C3_P)
IO_BL12: J14.B93(IO_B8A_TX_T28_B3_N)
IO_BL13: J14.B97(IO_B8A_TX_T26_B2_P)
IO_BL14: J14.B99(IO_B8A_TX_T26_B1_N)
IO_BL15: J14.B101(IO_B8A_TX_T24_E8_P)
IO_BL16: J14.B103(IO_B8A_TX_T24_D7_N)
IO_BL17: J14.B107(IO_B8A_TX_T22_D5_P)
IO_BL18: J14.B109(IO_B8A_TX_T22_C4_N)
IO_BL19: J14.B111(IO_B8A_TX_T20_D6_P)
IO_BL20: J14.B113(IO_B8A_TX_T20_C5_N)
IO_BL21: J14.B117(IO_B8A_TX_T18_A4_P)
IO_BL22: J14.B119(IO_B8A_TX_T18_A3_N)
IO_BL23: J14.B123(IO_B8A_TX_T16_A6_P)
IO_BL24: J14.B125(IO_B8A_TX_T16_A5_N)
IO_BL25: J14.B129(IO_B8A_TX_T14_C10_P)
IO_BL26: J14.B131(IO_B8A_TX_T14_C9_N)
IO_BL27: J14.B133(IO_B8A_TX_T12_C8_P)
IO_BL28: J14.B135(IO_B8A_TX_T12_B8_N)
IO_BL29: J14.B139(IO_B8A_TX_T10_C7_P)
IO_BL30: J14.B141(IO_B8A_TX_T10_B7_N)
IO_BL31: J14.B145(IO_B8A_TX_T8_A9_P)
IO_BL32: J14.B147(IO_B8A_TX_T8_A8_N)
IO_BL33: J14.B151(IO_B8A_TX_T6_C12_P)
IO_BL34: J14.B153(IO_B8A_TX_T6_B11_N)
IO_BL35: J14.B157(IO_B8A_TX_T4_A11_P)
IO_BL36: J14.B159(IO_B8A_TX_T4_A10_N)
IO_BL37: J14.B163(IO_B8A_TX_T2_B13_P)
IO_BL38: J14.B165(IO_B8A_TX_T2_A13_N)
IO_BR1: J14.B72(IO_B8A_RX_T37_J10_P)
IO_BR2: J14.B74(IO_B8A_RX_T37_J9_N)
IO_BR3: J14.B78(IO_B8A_CLK6_T9_K14_P)
IO_BR4: J14.B80(IO_B8A_CLK6_T9_J14_N)
IO_BR5: J14.B84(IO_B8A_RX_T29_K12_P)
IO_BR6: J14.B86(IO_B8A_RX_T29_J12_N)
IO_BR7: J14.B90(IO_B8A_RX_T33_K7_P)
IO_BR8: J14.B92(IO_B8A_RX_T33_K8_N)
IO_BR9: J14.B94(IO_B8A_RX_T25_J7_P)
IO_BR10: J14.B96(IO_B8A_RX_T25_H7_N)
IO_BR11: J14.B100(IO_B8A_RX_T17_H8_P)
IO_BR12: J14.B102(IO_B8A_RX_T17_G8_N)
IO_BR13: J14.B104(IO_B8A_RX_T21_H13_P)
IO_BR14: J14.B106(IO_B8A_RX_T21_H12_N)
IO_BR15: J14.B110(IO_B8A_RX_T31_G12_P)
IO_BR16: J14.B112(IO_B8A_RX_T31_G11_N)
IO_BR17: J14.B114(IO_B8A_RX_T23_F11_P)
IO_BR18: J14.B116(IO_B8A_RX_T23_E11_N)
IO_BR19: J14.B120(IO_B8A_RX_T35_G10_P)
IO_BR20: J14.B122(IO_B8A_RX_T35_F10_N)
IO_BR21: J14.B124(IO_B8A_RX_T19_E12_P)
IO_BR22: J14.B126(IO_B8A_RX_T19_D12_N)
IO_BR23: J14.B130(IO_B8A_RX_T15_F13_P)
IO_BR24: J14.B132(IO_B8A_RX_T15_E13_N)
IO_BR25: J14.B136(IO_B8A_RX_T27_B6_P)
IO_BR26: J14.B138(IO_B8A_RX_T27_B5_N)
IO_BR27: J14.B142(IO_B8A_RX_T13_H14_P)
IO_BR28: J14.B144(IO_B8A_RX_T13_G13_N)
IO_BR29: J14.B148(IO_B8A_RX_T11_E9_P)
IO_BR30: J14.B150(IO_B8A_RX_T11_D9_N)
IO_BR31: J14.B154(IO_B8A_RX_T7_D11_P)
IO_BR32: J14.B156(IO_B8A_RX_T7_D10_N)
IO_BR33: J14.B160(IO_B8A_RX_T5_F15_P)
IO_BR34: J14.B162(IO_B8A_RX_T5_F14_N)
IO_BR35: J14.B164(IO_B8A_RX_T3_C13_P)
IO_BR36: J14.B166(IO_B8A_RX_T3_B12_N)
MGT_REFCLK0_N: J14.B6(MGT_REFCLK0_W7_N) ; port MGT_RCLK0.IO_N  [project net GTP_REF0.IO_N]
MGT_REFCLK0_P: J14.B4(MGT_REFCLK0_W8_P) ; port MGT_RCLK0.IO_P  [project net GTP_REF0.IO_P]
MGT_REFCLK1_N: J14.B12(MGT_REFCLK1_T8_N) ; port MGT_RCLK1.IO_N  [project net GTP_REF1.IO_N]
MGT_REFCLK1_P: J14.B10(MGT_REFCLK1_T9_P) ; port MGT_RCLK1.IO_P  [project net GTP_REF1.IO_P]
MGT_REFCLK2_N: J14.B5(MGT_REFCLK2_P8_N) ; port MGT_RCLK2.IO_N  [project net GTP_REF2.IO_N]
MGT_REFCLK2_P: J14.B3(MGT_REFCLK2_P9_P) ; port MGT_RCLK2.IO_P  [project net GTP_REF2.IO_P]
MGT_RX0_N: J14.B20(MGT_RX0_AE1_N) ; port MGT_RX0.IO_N  [project net SFP_RX_0.IO_N]
MGT_RX0_P: J14.B16(MGT_RX0_AE2_P) ; port MGT_RX0.IO_P  [project net SFP_RX_0.IO_P]
MGT_RX1_N: J14.B28(MGT_RX1_AC1_N) ; port MGT_RX1.IO_N
MGT_RX1_P: J14.B24(MGT_RX1_AC2_P) ; port MGT_RX1.IO_P
MGT_RX2_N: J14.B36(MGT_RX2_AA1_N) ; port MGT_RX2.IO_N
MGT_RX2_P: J14.B32(MGT_RX2_AA2_P) ; port MGT_RX2.IO_P
MGT_RX3_N: J14.B44(MGT_RX3_W1_N) ; port MGT_RX3.IO_N  [project net SFP_RX_1.IO_N]
MGT_RX3_P: J14.B40(MGT_RX3_W2_P) ; port MGT_RX3.IO_P  [project net SFP_RX_1.IO_P]
MGT_RX4N: J14.B50(MGT_RX4_U1_N) ; port MGT_RX4.IO_N  [project net SFP_RX_2.IO_N]
MGT_RX4P: J14.B48(MGT_RX4_U2_P) ; port MGT_RX4.IO_P  [project net SFP_RX_2.IO_P]
MGT_RX5N: J14.B56(MGT_RX5_R1_N) ; port MGT_RX5.IO_N  [project net SFP_RX_3.IO_N]
MGT_RX5P: J14.B54(MGT_RX5_R2_P) ; port MGT_RX5.IO_P  [project net SFP_RX_3.IO_P]
MGT_RX6N: J14.B62(MGT_RX6_N1_N) ; port MGT_RX6.IO_N
MGT_RX6P: J14.B60(MGT_RX6_N2_P) ; port MGT_RX6.IO_P
MGT_RX7N: J14.B68(MGT_RX7_L1_N) ; port MGT_RX7.IO_N
MGT_RX7P: J14.B66(MGT_RX7_L2_P) ; port MGT_RX7.IO_P
MGT_TX0_N: J14.B17(MGT_TX0_AD3_N) ; port MGT_TX0.IO_N  [project net SFP_TX_0.IO_N]
MGT_TX0_P: J14.B13(MGT_TX0_AD4_P) ; port MGT_TX0.IO_P  [project net SFP_TX_0.IO_P]
MGT_TX1_N: J14.B25(MGT_TX1_AB3_N) ; port MGT_TX1.IO_N
MGT_TX1_P: J14.B21(MGT_TX1_AB4_P) ; port MGT_TX1.IO_P
MGT_TX2_N: J14.B33(MGT_TX2_Y3_N) ; port MGT_TX2.IO_N
MGT_TX2_P: J14.B29(MGT_TX2_Y4_P) ; port MGT_TX2.IO_P
MGT_TX3_N: J14.B41(MGT_TX3_V3_N) ; port MGT_TX3.IO_N  [project net SFP_TX_1.IO_N]
MGT_TX3_P: J14.B37(MGT_TX3_V4_P) ; port MGT_TX3.IO_P  [project net SFP_TX_1.IO_P]
MGT_TX4_N: J14.B47(MGT_TX4_T3_N) ; port MGT_TX4.IO_N  [project net SFP_TX_2.IO_N]
MGT_TX4_P: J14.B45(MGT_TX4_T4_P) ; port MGT_TX4.IO_P  [project net SFP_TX_2.IO_P]
MGT_TX5_N: J14.B53(MGT_TX5_P3_N) ; port MGT_TX5.IO_N  [project net SFP_TX_3.IO_N]
MGT_TX5_P: J14.B51(MGT_TX5_P4_P) ; port MGT_TX5.IO_P  [project net SFP_TX_3.IO_P]
MGT_TX6_N: J14.B63(MGT_TX6_M4_P) ; port MGT_TX6.IO_N
MGT_TX6_P: J14.B65(MGT_TX6_M3_N) ; port MGT_TX6.IO_P
MGT_TX7N: J14.B71(MGT_TX7_K3_N) ; port MGT_TX7.IO_N
MGT_TX7P: J14.B69(MGT_TX7_K4_P) ; port MGT_TX7.IO_P

Not connected (* = marked no-connect by the designer): J14 B8(VMON_1V35) B167(VMON_1V2) B168(VMON_1V55)

### Buses and harness runs
bus IO_BL[38..1] = port IO_BL[38..1]
bus IO_BR[36..1] = port IO_BR[36..1]

### Layout directives
differential pair; rule Differential Pairs Routing [Pref Gap = 0.175mm    Min Gap  = 0.075mm    Max Gap  = 0.5mmPref Width = 0.25mm    Min Width  = 0.075mm    Max Width  = 0.5mm]: GTP_REF0.IO_N, GTP_REF0.IO_P, GTP_REF1.IO_N, GTP_REF1.IO_P, GTP_REF2.IO_N, GTP_REF2.IO_P, MGT_TX6_N, MGT_TX6_P, SFP_RX_0.IO_N, SFP_RX_0.IO_P, SFP_RX_1.IO_N, SFP_RX_1.IO_P, SFP_RX_2.IO_N, SFP_RX_2.IO_P, SFP_RX_3.IO_N, SFP_RX_3.IO_P, SFP_TX_0.IO_N, SFP_TX_0.IO_P, SFP_TX_1.IO_N, SFP_TX_1.IO_P, SFP_TX_2.IO_N, SFP_TX_2.IO_P, SFP_TX_3.IO_N, SFP_TX_3.IO_P

### Library data of the parts
J14 = FX10A-168P-SV_ME-SA2+: as J14 on sheet cyc_v_som_A; HelpURL: https://www.hirose.com/product/document?clcode=CL0570-0044-8-71&productname=FX10A-168P-SV(71)&series=FX10&documenttype=Catalog&lang=ru&documentid=D31650_en; PartField: FX10A-168P-SV1(71); Value: 3 x FX10A-168P-SV1(71); THD Solders: 0